# EAGLE schematic MJ838 - rev.1c (EAGLE 9.6.2)
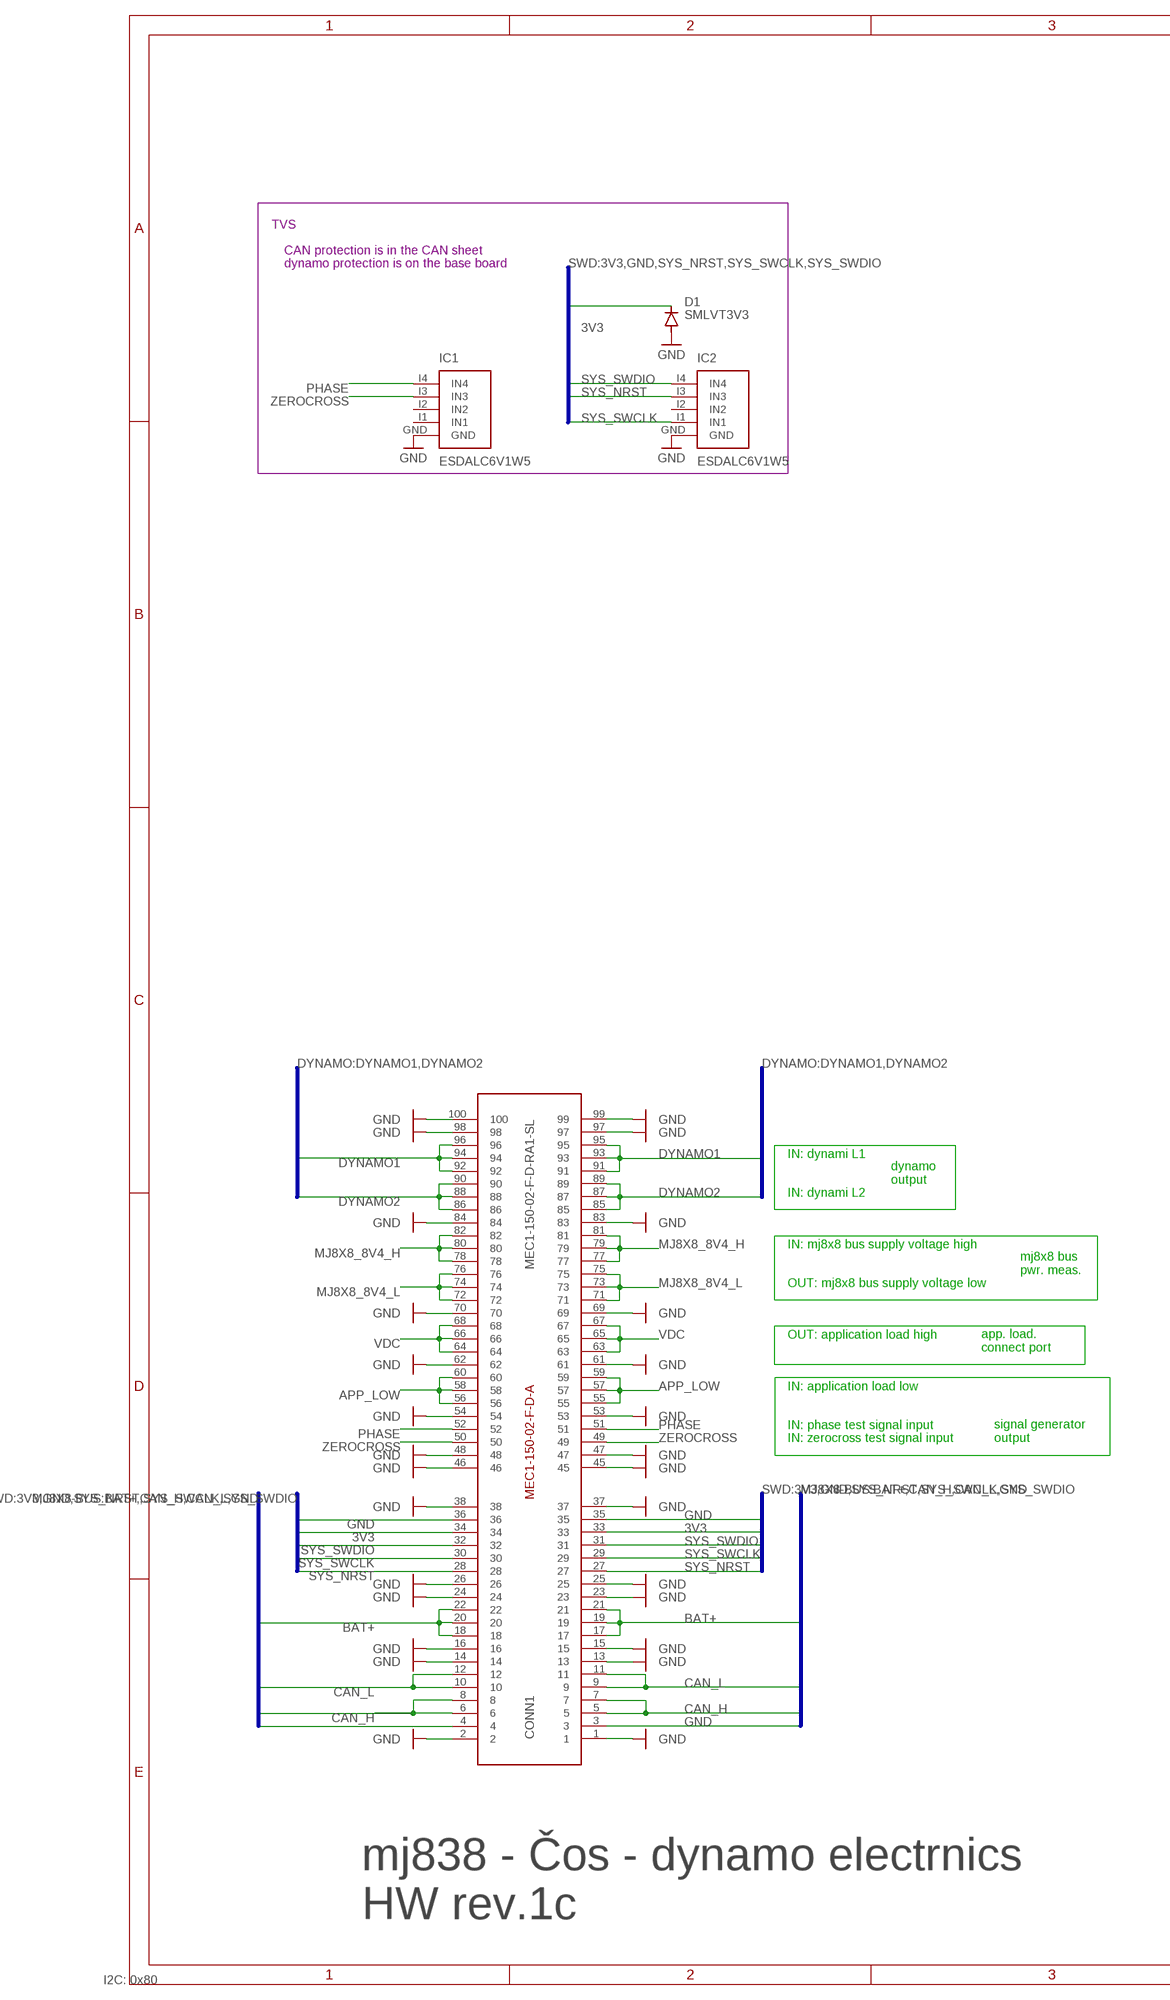
[diagram p0: schematic, sheet 1, part 1 of 2]
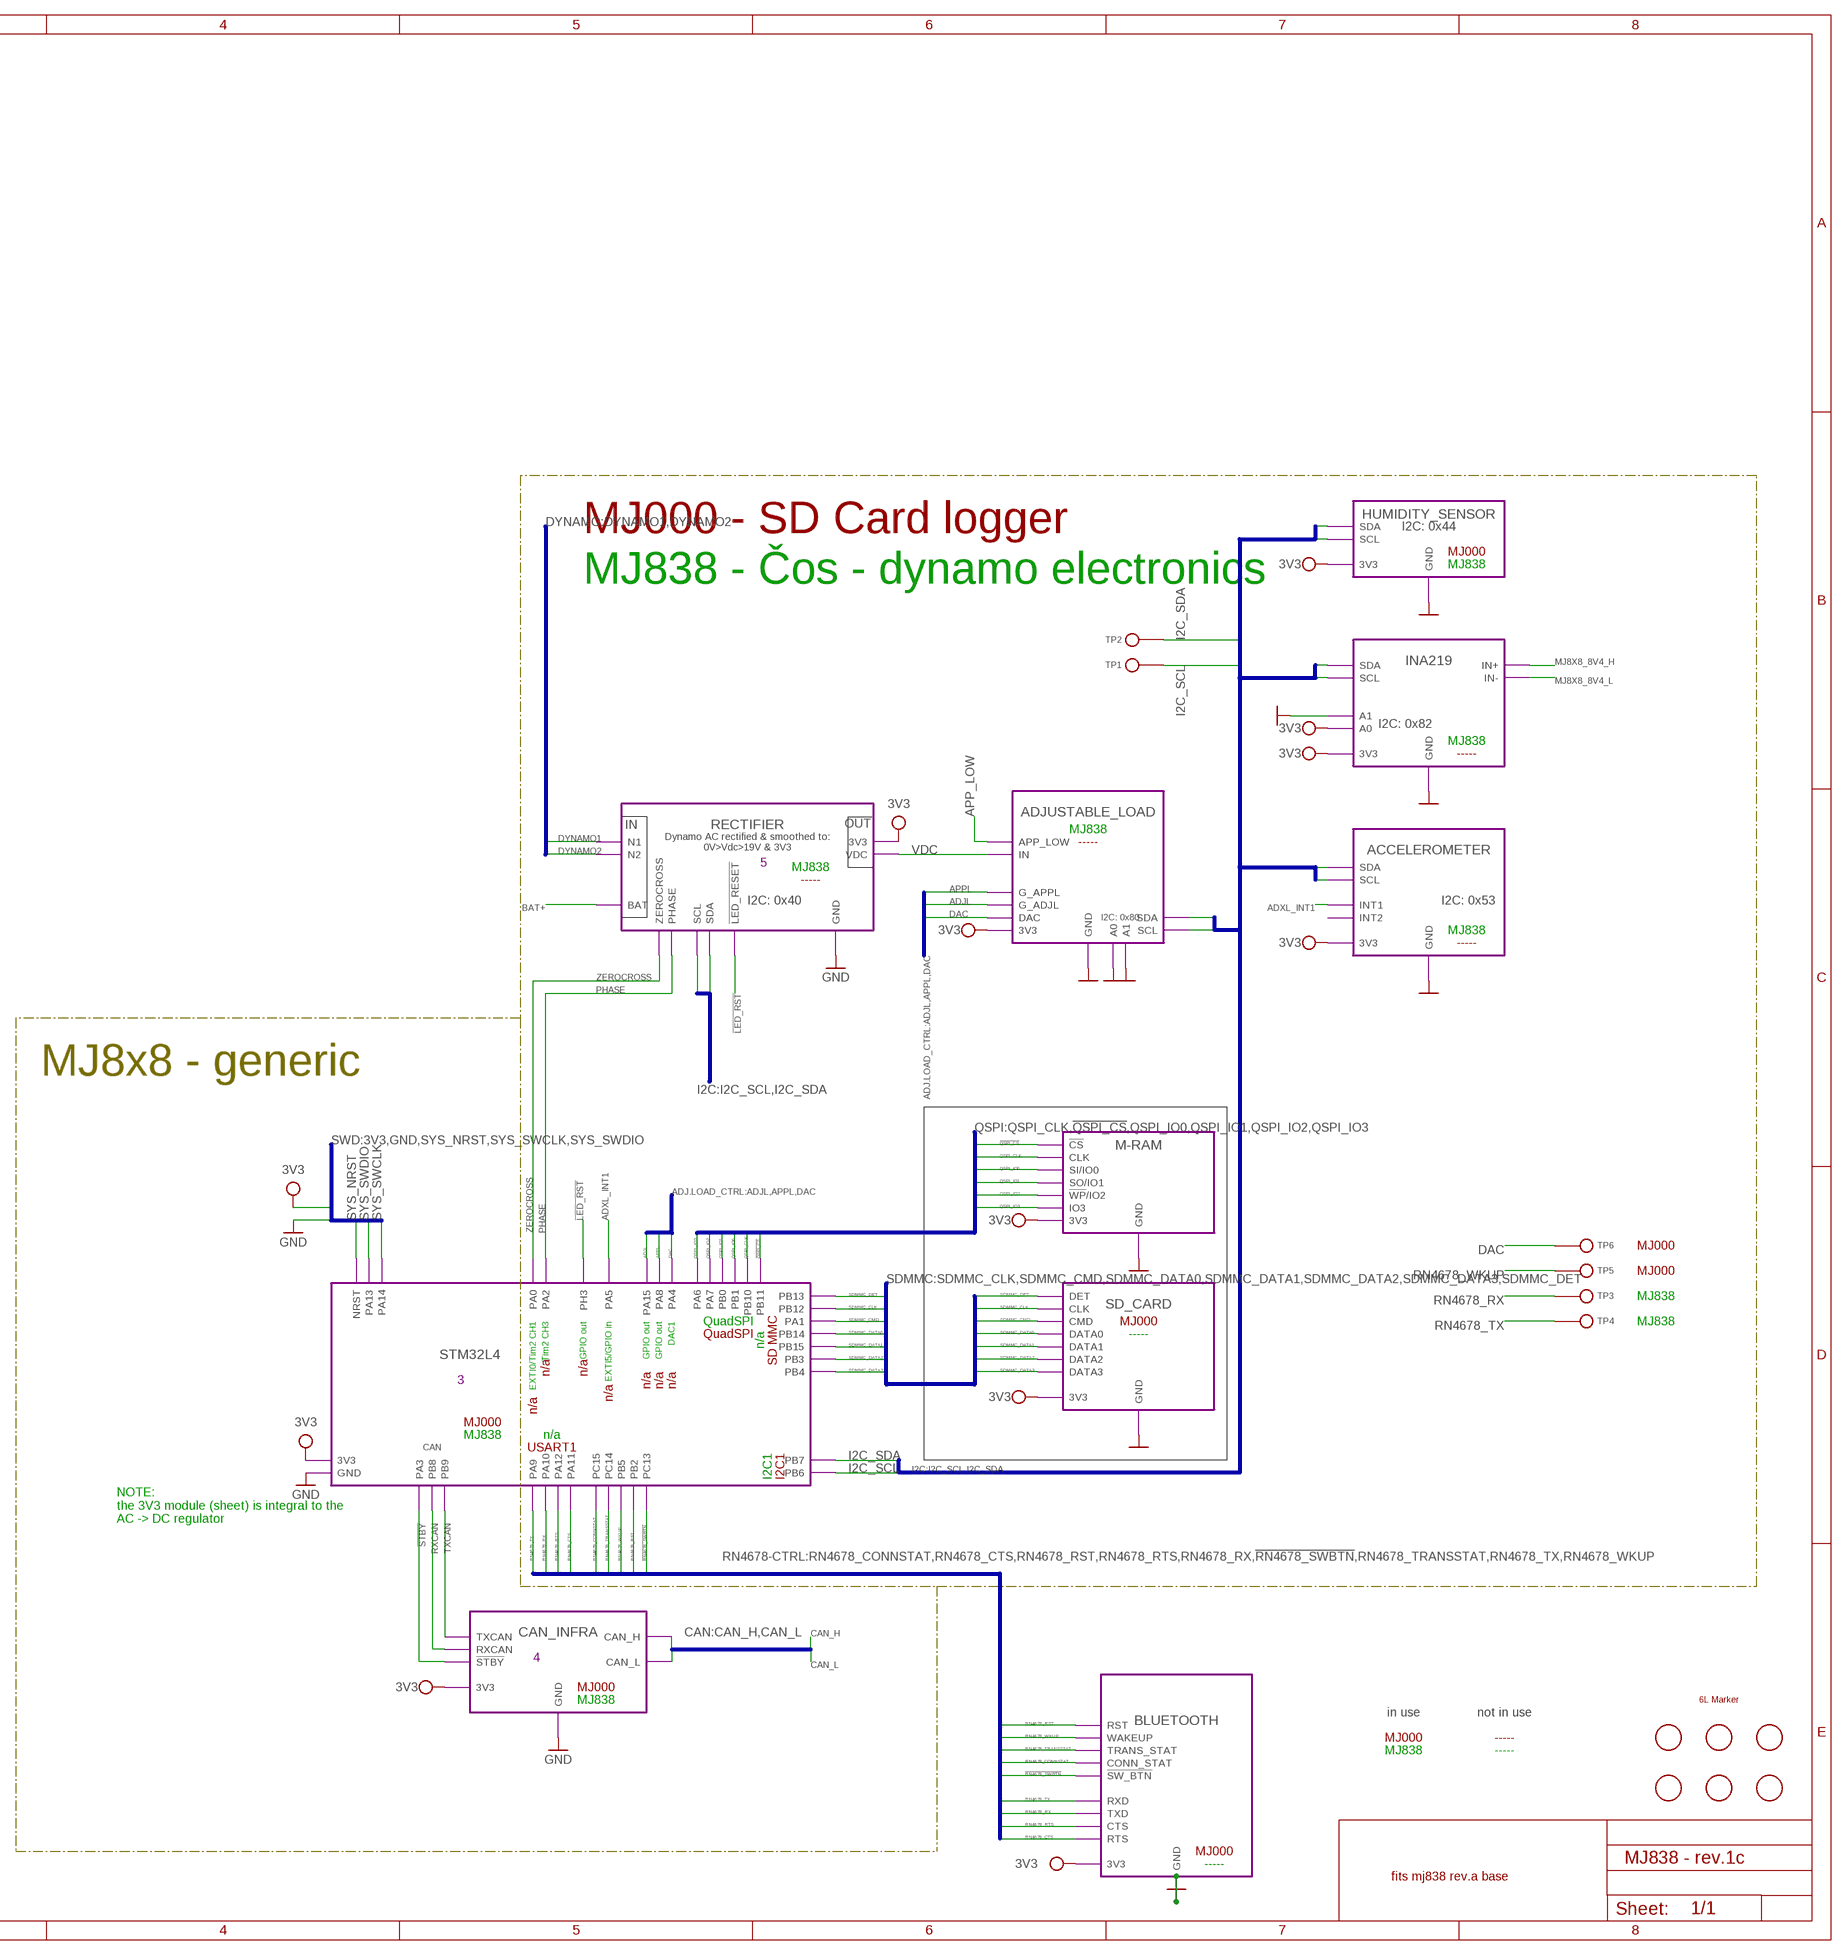
[diagram p1: schematic, sheet 1, part 2 of 2]

## Parts
CONN1  MEC1-150-02-F-D-RA1-SL  CARD-EDGE  [SMD]
D1  SMLVT3V3  DIODE-SMB  [SMB]
FID1  n/a  FIDUCIALFID_1MM  [FIDUCIAL_1MM]
FID2  n/a  FIDUCIALFID_1MM  [FIDUCIAL_1MM]
FID3  n/a  FIDUCIALFID_1MM  [FIDUCIAL_1MM]
FID4  n/a  FIDUCIALFID_1MM  [FIDUCIAL_1MM]
FID5  n/a  FIDUCIALFID_1MM  [FIDUCIAL_1MM]
FID6  n/a  FIDUCIALFID_1MM  [FIDUCIAL_1MM]
IC1  ESDALC6V1W5  ESDALC6  [SOT323-5]
IC2  ESDALC6V1W5  ESDALC6  [SOT323-5]
MARKER1  6 layer  6L  [6L]
TP1  CAN high  TPTH-0.9  [TH-0.9]
TP2  CAN high  TPTH-0.9  [TH-0.9]
TP3  CAN high  TPTH-0.9  [TH-0.9]
TP4  CAN high  TPTH-0.9  [TH-0.9]
TP5  CAN high  TPTH-0.9  [TH-0.9]
TP6  CAN high  TPTH-0.9  [TH-0.9]

## Module instances
STM32L4 = STM32
CAN_INFRA = CAN_INFRA
RECTIFIER = RECTIFIER
ADJUSTABLE_LOAD = ADJUSTABLE_LOAD
M-RAM = M-RAM
HUMIDITY_SENSOR = HUMIDITY
INA1 = INA219
SD_CARD = SD_CARD
ACCELEROMETER = ACCELEROMETER
BLUETOOTH = BLUETOOTH

## Nets
3V3 [3V3]: CONN1.33 CONN1.34 D1.C ; port STM32L4.3V3 CAN_INFRA.3V3 RECTIFIER.3V3 M-RAM.3V3 HUMIDITY_SENSOR.3V3 INA1.3V3 INA1.A0 ACCELEROMETER.3V3 ADJUSTABLE_LOAD.3V3 SD_CARD.3V3 BLUETOOTH.3V3
!LED_RST! [signal]: port RECTIFIER.!LED_RESET! STM32L4.PH3
!QSPI_CS! [signal]: port M-RAM.!CS! STM32L4.PB11
!RN4678_SWBTN! [signal]: port BLUETOOTH.!SW_BTN! STM32L4.PC13
!STBY! [signal]: port CAN_INFRA.!STBY! STM32L4.PA3
ADJL [signal]: port ADJUSTABLE_LOAD.G_ADJL STM32L4.PA15
ADXL_INT1 [signal]: port ACCELEROMETER.INT1 STM32L4.PA5
APP_LOW [signal]: CONN1.55 CONN1.56 CONN1.57 CONN1.58 CONN1.59 CONN1.60 ; port ADJUSTABLE_LOAD.APP_LOW
APPL [signal]: port ADJUSTABLE_LOAD.G_APPL STM32L4.PA8
BAT+ [BAT+]: CONN1.17 CONN1.18 CONN1.19 CONN1.20 CONN1.21 CONN1.22 ; port RECTIFIER.BAT
CAN_H [signal]: CONN1.5 CONN1.6 CONN1.7 CONN1.8 ; port CAN_INFRA.CAN_H
CAN_L [signal]: CONN1.9 CONN1.10 CONN1.11 CONN1.12 ; port CAN_INFRA.CAN_L
DAC [signal]: TP6.P$1(TP$1) ; port ADJUSTABLE_LOAD.DAC STM32L4.PA4
DYNAMO1 [Vdynamo]: CONN1.91 CONN1.92 CONN1.93 CONN1.94 CONN1.95 CONN1.96 ; port RECTIFIER.N1
DYNAMO2 [Vdynamo]: CONN1.85 CONN1.86 CONN1.87 CONN1.88 CONN1.89 CONN1.90 ; port RECTIFIER.N2
GND: CONN1.1 CONN1.2 CONN1.3 CONN1.4 CONN1.13 CONN1.14 CONN1.15 CONN1.16 CONN1.23 CONN1.24 CONN1.25 CONN1.26 CONN1.35 CONN1.36 CONN1.37 CONN1.38 CONN1.45 CONN1.46 CONN1.47 CONN1.48 CONN1.53 CONN1.54 CONN1.61 CONN1.62 CONN1.69 CONN1.70 CONN1.83 CONN1.84 CONN1.97 CONN1.98 CONN1.99 CONN1.100 D1.A IC1.GND IC2.GND ; port CAN_INFRA.GND RECTIFIER.GND ADJUSTABLE_LOAD.GND M-RAM.GND HUMIDITY_SENSOR.GND INA1.GND INA1.A1 SD_CARD.GND ACCELEROMETER.GND STM32L4.GND ADJUSTABLE_LOAD.A0 ADJUSTABLE_LOAD.A1 BLUETOOTH.GND
I2C_SCL [signal]: TP1.P$1(TP$1) ; port HUMIDITY_SENSOR.SCL RECTIFIER.SCL INA1.SCL ACCELEROMETER.SCL STM32L4.PB6 ADJUSTABLE_LOAD.SCL
I2C_SDA [signal]: TP2.P$1(TP$1) ; port HUMIDITY_SENSOR.SDA RECTIFIER.SDA INA1.SDA ACCELEROMETER.SDA STM32L4.PB7 ADJUSTABLE_LOAD.SDA
MJ8X8_8V4_H [BAT+]: CONN1.77 CONN1.78 CONN1.79 CONN1.80 CONN1.81 CONN1.82 ; port INA1.IN+
MJ8X8_8V4_L [BAT+]: CONN1.71 CONN1.72 CONN1.73 CONN1.74 CONN1.75 CONN1.76 ; port INA1.IN-
PHASE [signal]: CONN1.51 CONN1.52 IC1.I4(IN4) ; port RECTIFIER.PHASE STM32L4.PA2
QSPI_CLK [signal]: port M-RAM.CLK STM32L4.PB10
QSPI_IO0 [signal]: port M-RAM.SI/IO0 STM32L4.PB1
QSPI_IO1 [signal]: port M-RAM.SO/IO1 STM32L4.PB0
QSPI_IO2 [signal]: port M-RAM.!WP!/IO2 STM32L4.PA7
QSPI_IO3 [signal]: port M-RAM.IO3 STM32L4.PA6
RN4678_CONNSTAT [signal]: port BLUETOOTH.CONN_STAT STM32L4.PC15
RN4678_CTS [signal]: port STM32L4.PA11 BLUETOOTH.RTS
RN4678_RST [signal]: port BLUETOOTH.RST STM32L4.PB2
RN4678_RTS [signal]: port STM32L4.PA12 BLUETOOTH.CTS
RN4678_RX [signal]: TP3.P$1(TP$1) ; port STM32L4.PA10 BLUETOOTH.TXD
RN4678_TRANSSTAT [signal]: port BLUETOOTH.TRANS_STAT STM32L4.PC14
RN4678_TX [signal]: TP4.P$1(TP$1) ; port STM32L4.PA9 BLUETOOTH.RXD
RN4678_WKUP [signal]: TP5.P$1(TP$1) ; port BLUETOOTH.WAKEUP STM32L4.PB5
RXCAN [signal]: port CAN_INFRA.RXCAN STM32L4.PB8
SDMMC_CLK [signal]: port SD_CARD.CLK STM32L4.PB12
SDMMC_CMD [signal]: port SD_CARD.CMD STM32L4.PA1
SDMMC_DATA0 [signal]: port SD_CARD.DATA0 STM32L4.PB14
SDMMC_DATA1 [signal]: port SD_CARD.DATA1 STM32L4.PB15
SDMMC_DATA2 [signal]: port SD_CARD.DATA2 STM32L4.PB3
SDMMC_DATA3 [signal]: port SD_CARD.DATA3 STM32L4.PB4
SDMMC_DET [signal]: port SD_CARD.DET STM32L4.PB13
SYS_NRST [signal]: CONN1.27 CONN1.28 IC2.I3(IN3) ; port STM32L4.NRST
SYS_SWCLK [signal]: CONN1.29 CONN1.30 IC2.I1(IN1) ; port STM32L4.PA14
SYS_SWDIO [signal]: CONN1.31 CONN1.32 IC2.I4(IN4) ; port STM32L4.PA13
TXCAN [signal]: port STM32L4.PB9 CAN_INFRA.TXCAN
VDC [Vdc]: CONN1.63 CONN1.64 CONN1.65 CONN1.66 CONN1.67 CONN1.68 ; port ADJUSTABLE_LOAD.IN RECTIFIER.VDC
ZEROCROSS [signal]: CONN1.49 CONN1.50 IC1.I3(IN3) ; port RECTIFIER.ZEROCROSS STM32L4.PA0
Unconnected: IC1.I1(IN1) IC1.I2(IN2) IC2.I2(IN2)

## Buses
CAN:CAN_H,CAN_L
SWD:3V3,GND,SYS_NRST,SYS_SWCLK,SYS_SWDIO
I2C:I2C_SCL,I2C_SDA
MJ8X8-BUS:BAT+,CAN_H,CAN_L,GND
DYNAMO:DYNAMO1,DYNAMO2
SDMMC:SDMMC_CLK,SDMMC_CMD,SDMMC_DATA0,SDMMC_DATA1,SDMMC_DATA2,SDMMC_DATA3,SDMMC_DET
QSPI:QSPI_CLK,!QSPI_CS!,QSPI_IO0,QSPI_IO1,QSPI_IO2,QSPI_IO3
RN4678-CTRL:RN4678_CONNSTAT,RN4678_CTS,RN4678_RST,RN4678_RTS,RN4678_RX,!RN4678_SWBTN!,RN4678_TRANSSTAT,RN4678_TX,RN4678_WKUP
ADJ.LOAD_CTRL:ADJL,APPL,DAC

## Notes on the sheet
- TVS
- CAN protection is in the CAN sheet
- dynamo protection is on the base board
- MJ000 - SD Card logger
- I2C: 0x44
- MJ838 - Čos - dynamo electronics | MJ000
- MJ838
- I2C: 0x82
- MJ838
- -----
- IN | OUT | MJ838
- Dynamo AC rectified & smoothed to:
  0V>Vdc>19V & 3V3
- -----
- 5 | MJ838
- -----
- I2C: 0x40 | I2C: 0x53
- I2C: 0x80
- MJ838
- -----
- MJ8x8 - generic
- IN: dynami L1
- dynamo
  output
- IN: dynami L2
- IN: mj8x8 bus supply voltage high
- mj8x8 bus
  pwr. meas.
- MJ000
- OUT: mj8x8 bus supply voltage low
- MJ000
- MJ838
- OUT: application load high
- app. load.
  connect port
- EXTI0/Tim2 CH1 | Tim2 CH3 | GPIO out | EXTI5/GPIO in | GPIO out | GPIO out | DAC1 | QuadSPI | MJ000 | MJ838
- QuadSPI | -----
- n/a | SD MMC
- IN: application load low | n/a | n/a
- n/a | n/a | n/a
- 3 | n/a
- IN: phase test signal input | n/a
- IN: zerocross test signal input
- signal generator
  output
- MJ000
- MJ838 | n/a
- CAN | USART1
- I2C1 | I2C1
- NOTE:
  the 3V3 module (sheet) is integral to the
  AC -> DC regulator
- 4
- MJ000
- MJ838
- in use | not in use
- MJ000 | -----
- MJ838 | -----
- MJ000
- -----
- mj838 - Čos - dynamo electrnics
  HW rev.1c
- fits mj838 rev.a base
- I2C: 0x80

## Library data of the parts
CONN1 = Samtec MEC1 - Card Edge Connector:CARD-EDGE
D1 = diode:DIODE-: DIODE
FID1-FID6 = fiducials:FIDUCIAL
IC1 IC2 = ESDALCx - 4c ESD protection:ESDALC6
MARKER1 = Layer Markers:6L
TP1-TP6 = signal testpoint:TP

## Module STM32
Ports: GND(pwr) 3V3(pwr) NRST(in) PA13(io) PA14(in) PB9(out) PB8(in) PB6(out) PB7(io) PB4(io) PB3(io) PB14(io) PB15(io) PA1(io) PB12(out) PB13(in) PB1(io) PB0(io) PA7(io) PA6(io) PA0(in) PA4(out) PB10(out) PB11(out) PA9(out) PA10(in) PA11(in) PA12(out) PA8(out) PA15(out) PA2(in) PH3(out) PA3(out) PA5(in) PC13(out) PC14(in) PC15(in) PB2(out) PB5(out)
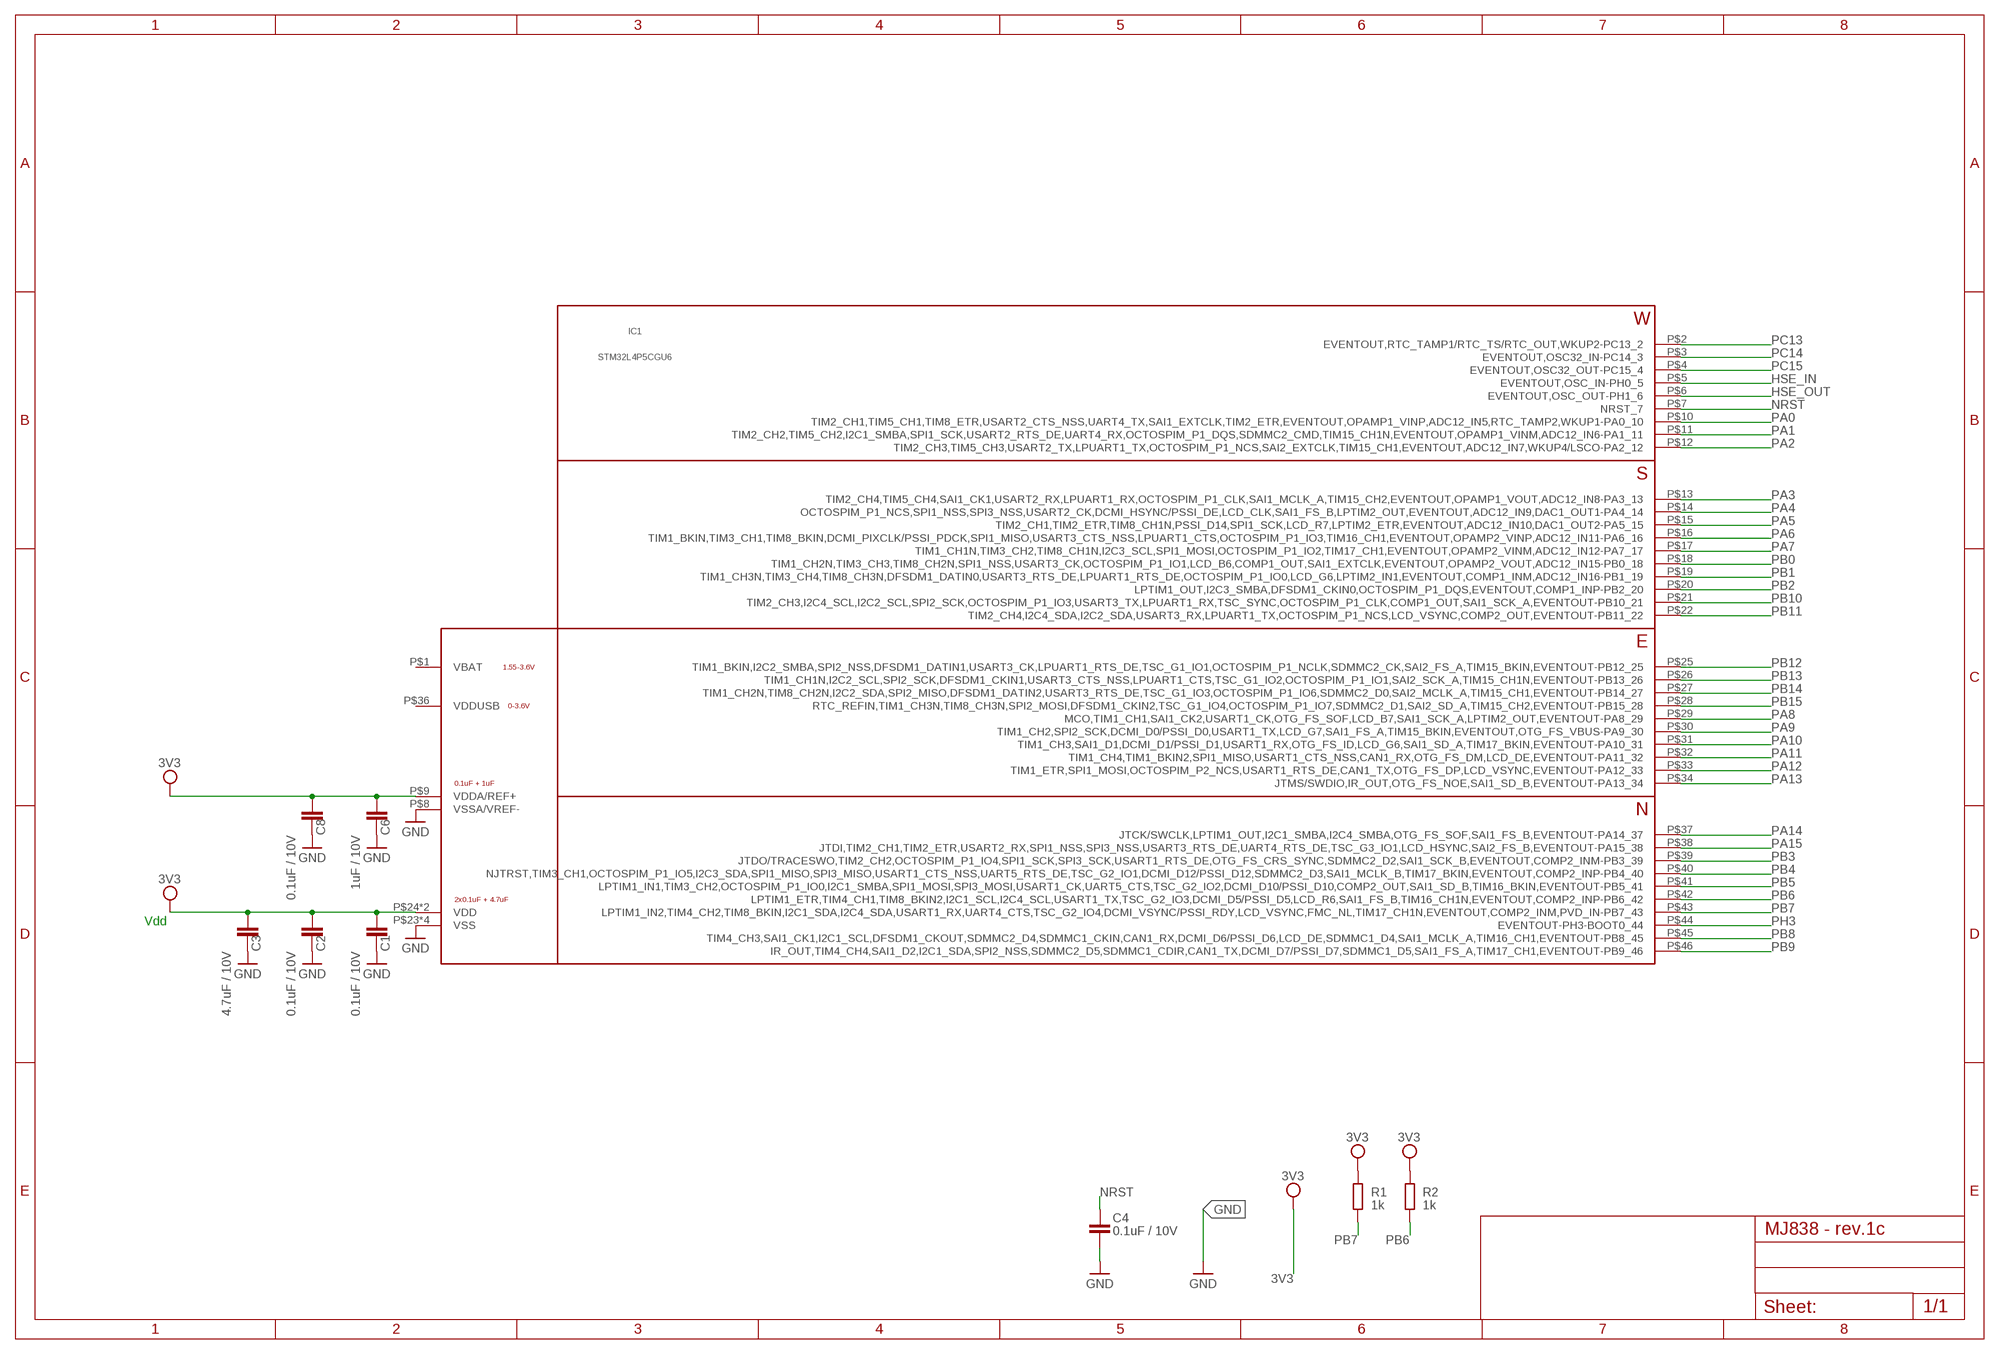
[diagram p2: schematic, module STM32, sheet 1]

### Parts
C1  0.1uF / 10V  C-EUC0402  [C0402]
C2  0.1uF / 10V  C-EUC0402  [C0402]
C3  4.7uF / 10V  C-EUC0402  [C0402]
C4  0.1uF / 10V  C-EUC0402  [C0402]
C6  1uF / 10V  C-EUC0402  [C0402]
C8  0.1uF / 10V  C-EUC0402  [C0402]
IC1  STM32L4P5CGU6  STM32L4P5CEU6  [UFQFPN48]
R1  1k  R-EU_R0402  [R0402]
R2  1k  R-EU_R0402  [R0402]

### Nets
3V3 [3V3]: C1.2 C2.2 C3.2 C6.2 C8.2 IC1.P$9(VDDA/REF+) IC1.P$24(VDD) IC1.P$48(VDD) R1.2 R2.2
GND: C1.1 C2.1 C3.1 C4.1 C6.1 C8.1 IC1.P$8(VSSA/VREF-) IC1.P$23(VSS) IC1.P$35(VSS) IC1.P$47(VSS) IC1.PAD(VSS)
HSE_IN [signal]: IC1.P$5(EVENTOUT,OSC_IN-PH0_5)
HSE_OUT [signal]: IC1.P$6(EVENTOUT,OSC_OUT-PH1_6)
NRST [signal]: C4.2 IC1.P$7(NRST_7)
PA0 [signal]: IC1.P$10(TIM2_CH1,TIM5_CH1,TIM8_ETR,USART2_CTS_NSS,UART4_TX,SAI1_EXTCLK,TIM2_ETR,EVENTOUT,OPAMP1_VINP,ADC12_IN5,RTC_TAMP2,WKUP1-PA0_10)
PA1 [signal]: IC1.P$11(TIM2_CH2,TIM5_CH2,I2C1_SMBA,SPI1_SCK,USART2_RTS_DE,UART4_RX,OCTOSPIM_P1_DQS,SDMMC2_CMD,TIM15_CH1N,EVENTOUT,OPAMP1_VINM,ADC12_IN6-PA1_11)
PA2 [signal]: IC1.P$12(TIM2_CH3,TIM5_CH3,USART2_TX,LPUART1_TX,OCTOSPIM_P1_NCS,SAI2_EXTCLK,TIM15_CH1,EVENTOUT,ADC12_IN7,WKUP4/LSCO-PA2_12)
PA3 [signal]: IC1.P$13(TIM2_CH4,TIM5_CH4,SAI1_CK1,USART2_RX,LPUART1_RX,OCTOSPIM_P1_CLK,SAI1_MCLK_A,TIM15_CH2,EVENTOUT,OPAMP1_VOUT,ADC12_IN8-PA3_13)
PA4 [signal]: IC1.P$14(OCTOSPIM_P1_NCS,SPI1_NSS,SPI3_NSS,USART2_CK,DCMI_HSYNC/PSSI_DE,LCD_CLK,SAI1_FS_B,LPTIM2_OUT,EVENTOUT,ADC12_IN9,DAC1_OUT1-PA4_14)
PA5 [signal]: IC1.P$15(TIM2_CH1,TIM2_ETR,TIM8_CH1N,PSSI_D14,SPI1_SCK,LCD_R7,LPTIM2_ETR,EVENTOUT,ADC12_IN10,DAC1_OUT2-PA5_15)
PA6 [signal]: IC1.P$16(TIM1_BKIN,TIM3_CH1,TIM8_BKIN,DCMI_PIXCLK/PSSI_PDCK,SPI1_MISO,USART3_CTS_NSS,LPUART1_CTS,OCTOSPIM_P1_IO3,TIM16_CH1,EVENTOUT,OPAMP2_VINP,ADC12_IN11-PA6_16)
PA7 [signal]: IC1.P$17(TIM1_CH1N,TIM3_CH2,TIM8_CH1N,I2C3_SCL,SPI1_MOSI,OCTOSPIM_P1_IO2,TIM17_CH1,EVENTOUT,OPAMP2_VINM,ADC12_IN12-PA7_17)
PA8 [signal]: IC1.P$29(MCO,TIM1_CH1,SAI1_CK2,USART1_CK,OTG_FS_SOF,LCD_B7,SAI1_SCK_A,LPTIM2_OUT,EVENTOUT-PA8_29)
PA9 [signal]: IC1.P$30(TIM1_CH2,SPI2_SCK,DCMI_D0/PSSI_D0,USART1_TX,LCD_G7,SAI1_FS_A,TIM15_BKIN,EVENTOUT,OTG_FS_VBUS-PA9_30)
PA10 [signal]: IC1.P$31(TIM1_CH3,SAI1_D1,DCMI_D1/PSSI_D1,USART1_RX,OTG_FS_ID,LCD_G6,SAI1_SD_A,TIM17_BKIN,EVENTOUT-PA10_31)
PA11 [signal]: IC1.P$32(TIM1_CH4,TIM1_BKIN2,SPI1_MISO,USART1_CTS_NSS,CAN1_RX,OTG_FS_DM,LCD_DE,EVENTOUT-PA11_32)
PA12 [signal]: IC1.P$33(TIM1_ETR,SPI1_MOSI,OCTOSPIM_P2_NCS,USART1_RTS_DE,CAN1_TX,OTG_FS_DP,LCD_VSYNC,EVENTOUT-PA12_33)
PA13 [signal]: IC1.P$34(JTMS/SWDIO,IR_OUT,OTG_FS_NOE,SAI1_SD_B,EVENTOUT-PA13_34)
PA14 [signal]: IC1.P$37(JTCK/SWCLK,LPTIM1_OUT,I2C1_SMBA,I2C4_SMBA,OTG_FS_SOF,SAI1_FS_B,EVENTOUT-PA14_37)
PA15 [signal]: IC1.P$38(JTDI,TIM2_CH1,TIM2_ETR,USART2_RX,SPI1_NSS,SPI3_NSS,USART3_RTS_DE,UART4_RTS_DE,TSC_G3_IO1,LCD_HSYNC,SAI2_FS_B,EVENTOUT-PA15_38)
PB0 [signal]: IC1.P$18(TIM1_CH2N,TIM3_CH3,TIM8_CH2N,SPI1_NSS,USART3_CK,OCTOSPIM_P1_IO1,LCD_B6,COMP1_OUT,SAI1_EXTCLK,EVENTOUT,OPAMP2_VOUT,ADC12_IN15-PB0_18)
PB1 [signal]: IC1.P$19(TIM1_CH3N,TIM3_CH4,TIM8_CH3N,DFSDM1_DATIN0,USART3_RTS_DE,LPUART1_RTS_DE,OCTOSPIM_P1_IO0,LCD_G6,LPTIM2_IN1,EVENTOUT,COMP1_INM,ADC12_IN16-PB1_19)
PB2 [signal]: IC1.P$20(LPTIM1_OUT,I2C3_SMBA,DFSDM1_CKIN0,OCTOSPIM_P1_DQS,EVENTOUT,COMP1_INP-PB2_20)
PB3 [signal]: IC1.P$39(JTDO/TRACESWO,TIM2_CH2,OCTOSPIM_P1_IO4,SPI1_SCK,SPI3_SCK,USART1_RTS_DE,OTG_FS_CRS_SYNC,SDMMC2_D2,SAI1_SCK_B,EVENTOUT,COMP2_INM-PB3_39)
PB4 [signal]: IC1.P$40(NJTRST,TIM3_CH1,OCTOSPIM_P1_IO5,I2C3_SDA,SPI1_MISO,SPI3_MISO,USART1_CTS_NSS,UART5_RTS_DE,TSC_G2_IO1,DCMI_D12/PSSI_D12,SDMMC2_D3,SAI1_MCLK_B,TIM17_BKIN,EVENTOUT,COMP2_INP-PB4_40)
PB5 [signal]: IC1.P$41(LPTIM1_IN1,TIM3_CH2,OCTOSPIM_P1_IO0,I2C1_SMBA,SPI1_MOSI,SPI3_MOSI,USART1_CK,UART5_CTS,TSC_G2_IO2,DCMI_D10/PSSI_D10,COMP2_OUT,SAI1_SD_B,TIM16_BKIN,EVENTOUT-PB5_41)
PB6 [signal]: IC1.P$42(LPTIM1_ETR,TIM4_CH1,TIM8_BKIN2,I2C1_SCL,I2C4_SCL,USART1_TX,TSC_G2_IO3,DCMI_D5/PSSI_D5,LCD_R6,SAI1_FS_B,TIM16_CH1N,EVENTOUT,COMP2_INP-PB6_42) R2.1
PB7 [signal]: IC1.P$43(LPTIM1_IN2,TIM4_CH2,TIM8_BKIN,I2C1_SDA,I2C4_SDA,USART1_RX,UART4_CTS,TSC_G2_IO4,DCMI_VSYNC/PSSI_RDY,LCD_VSYNC,FMC_NL,TIM17_CH1N,EVENTOUT,COMP2_INM,PVD_IN-PB7_43) R1.1
PB8 [signal]: IC1.P$45(TIM4_CH3,SAI1_CK1,I2C1_SCL,DFSDM1_CKOUT,SDMMC2_D4,SDMMC1_CKIN,CAN1_RX,DCMI_D6/PSSI_D6,LCD_DE,SDMMC1_D4,SAI1_MCLK_A,TIM16_CH1,EVENTOUT-PB8_45)
PB9 [signal]: IC1.P$46(IR_OUT,TIM4_CH4,SAI1_D2,I2C1_SDA,SPI2_NSS,SDMMC2_D5,SDMMC1_CDIR,CAN1_TX,DCMI_D7/PSSI_D7,SDMMC1_D5,SAI1_FS_A,TIM17_CH1,EVENTOUT-PB9_46)
PB10 [signal]: IC1.P$21(TIM2_CH3,I2C4_SCL,I2C2_SCL,SPI2_SCK,OCTOSPIM_P1_IO3,USART3_TX,LPUART1_RX,TSC_SYNC,OCTOSPIM_P1_CLK,COMP1_OUT,SAI1_SCK_A,EVENTOUT-PB10_21)
PB11 [signal]: IC1.P$22(TIM2_CH4,I2C4_SDA,I2C2_SDA,USART3_RX,LPUART1_TX,OCTOSPIM_P1_NCS,LCD_VSYNC,COMP2_OUT,EVENTOUT-PB11_22)
PB12 [signal]: IC1.P$25(TIM1_BKIN,I2C2_SMBA,SPI2_NSS,DFSDM1_DATIN1,USART3_CK,LPUART1_RTS_DE,TSC_G1_IO1,OCTOSPIM_P1_NCLK,SDMMC2_CK,SAI2_FS_A,TIM15_BKIN,EVENTOUT-PB12_25)
PB13 [signal]: IC1.P$26(TIM1_CH1N,I2C2_SCL,SPI2_SCK,DFSDM1_CKIN1,USART3_CTS_NSS,LPUART1_CTS,TSC_G1_IO2,OCTOSPIM_P1_IO1,SAI2_SCK_A,TIM15_CH1N,EVENTOUT-PB13_26)
PB14 [signal]: IC1.P$27(TIM1_CH2N,TIM8_CH2N,I2C2_SDA,SPI2_MISO,DFSDM1_DATIN2,USART3_RTS_DE,TSC_G1_IO3,OCTOSPIM_P1_IO6,SDMMC2_D0,SAI2_MCLK_A,TIM15_CH1,EVENTOUT-PB14_27)
PB15 [signal]: IC1.P$28(RTC_REFIN,TIM1_CH3N,TIM8_CH3N,SPI2_MOSI,DFSDM1_CKIN2,TSC_G1_IO4,OCTOSPIM_P1_IO7,SDMMC2_D1,SAI2_SD_A,TIM15_CH2,EVENTOUT-PB15_28)
PC13 [signal]: IC1.P$2(EVENTOUT,RTC_TAMP1/RTC_TS/RTC_OUT,WKUP2-PC13_2)
PC14 [signal]: IC1.P$3(EVENTOUT,OSC32_IN-PC14_3)
PC15 [signal]: IC1.P$4(EVENTOUT,OSC32_OUT-PC15_4)
PH3: IC1.P$44(EVENTOUT-PH3-BOOT0_44)

### Notes on the sheet
- Vdd

### Power pins joined to a net without a drawn wire
VBAT: IC1.P$1(VBAT)
VDDUSB: IC1.P$36(VDDUSB)

### Library data of the parts
C1 C2 C4 C6 = rcl:C-EU: CAPACITOR, European symbol; MFRNO: GRM155R62A104KE14J; SPICEPREFIX: C
C3 = rcl:C-EU: CAPACITOR, European symbol; MFRNO: GRM155R61A475MEAAJ; SPICEPREFIX: C
C8 = rcl:C-EU: CAPACITOR, European symbol; MFRNO: GRM155R61H105ME05J; SPICEPREFIX: C
IC1 = STM32L4P5xx:STM32L4P5CEU6
R1 R2 = rcl:R-EU_: RESISTOR, European symbol; MFRNO: ERA-2VEB1001X; SPICEPREFIX: R

## Module CAN_INFRA
Ports: GND(pwr) 3V3(pwr) CAN_H(io) CAN_L(io) TXCAN(in) RXCAN(out) !STBY!(in)
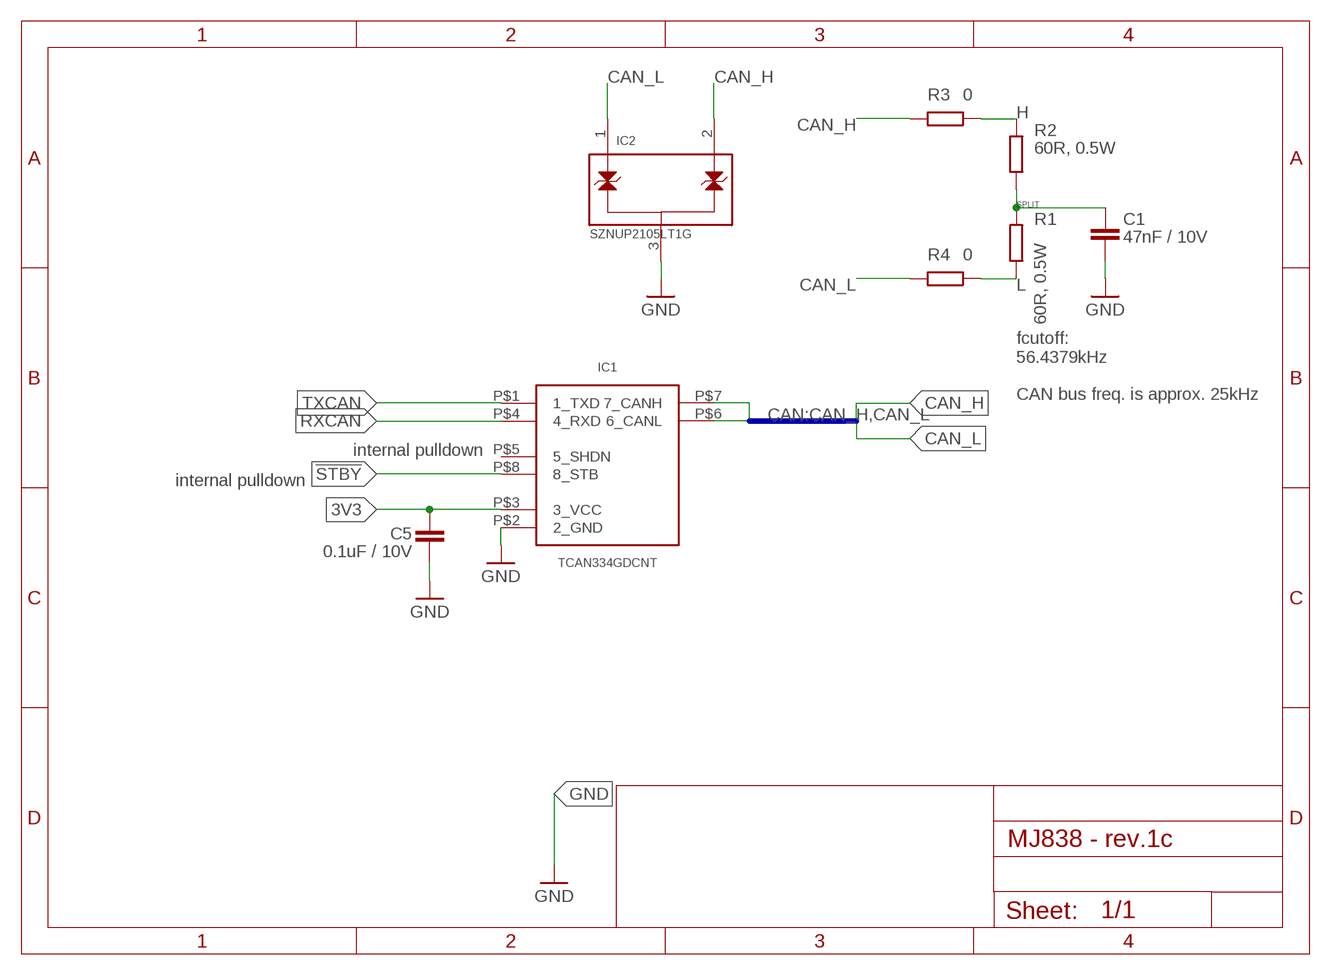
[diagram p3: schematic, module CAN_INFRA, sheet 1]

### Parts
C1  47nF / 10V  C-EUC0402  [C0402]
C5  0.1uF / 10V  C-EUC0402  [C0402]
IC1  TCAN334GDCNT  CAN33X  [SOT23-8]
IC2  SZNUP2105LT1G  NUP2105L  [SOT-23-3]
R1  60R, 0.5W  R-EU_R0805  [R0805]
R2  60R, 0.5W  R-EU_R0805  [R0805]
R3  0  R-EU_R0402  [R0402]
R4  0  R-EU_R0402  [R0402]

### Nets
3V3 [3V3]: C5.1 IC1.P$3(3_VCC)
!STBY! [signal]: IC1.P$8(8_STB)
CAN_H [signal]: IC1.P$7(7_CANH) IC2.2(PIN2) R3.2
CAN_L [signal]: IC1.P$6(6_CANL) IC2.1(PIN1) R4.2
GND: C1.2 C5.2 IC1.P$2(2_GND) IC2.3(PIN3)
H [signal]: R2.2 R3.1
L [signal]: R1.1 R4.1
RXCAN [signal]: IC1.P$4(4_RXD)
SPLIT [signal]: C1.1 R1.2 R2.1
TXCAN [signal]: IC1.P$1(1_TXD)
Unconnected: IC1.P$5(5_SHDN)

### Buses
CAN:CAN_H,CAN_L

### Notes on the sheet
- fcutoff:
  56.4379kHz
  
  CAN bus freq. is approx. 25kHz
- internal pulldown
- internal pulldown

### Library data of the parts
C1 C5 = rcl:C-EU: CAPACITOR, European symbol; SPICEPREFIX: C
IC1 = TCAN33x - 3.3V CAN Transciever:CAN33X
IC2 = NUP2105L - 27V ESD Protection Diode:NUP2105L
R1-R4 = rcl:R-EU_: RESISTOR, European symbol; SPICEPREFIX: R

## Module ZERO-CROSS_DETECTOR
Ports: GND(pwr) OUT(out) 3V3(pwr) AC(in)
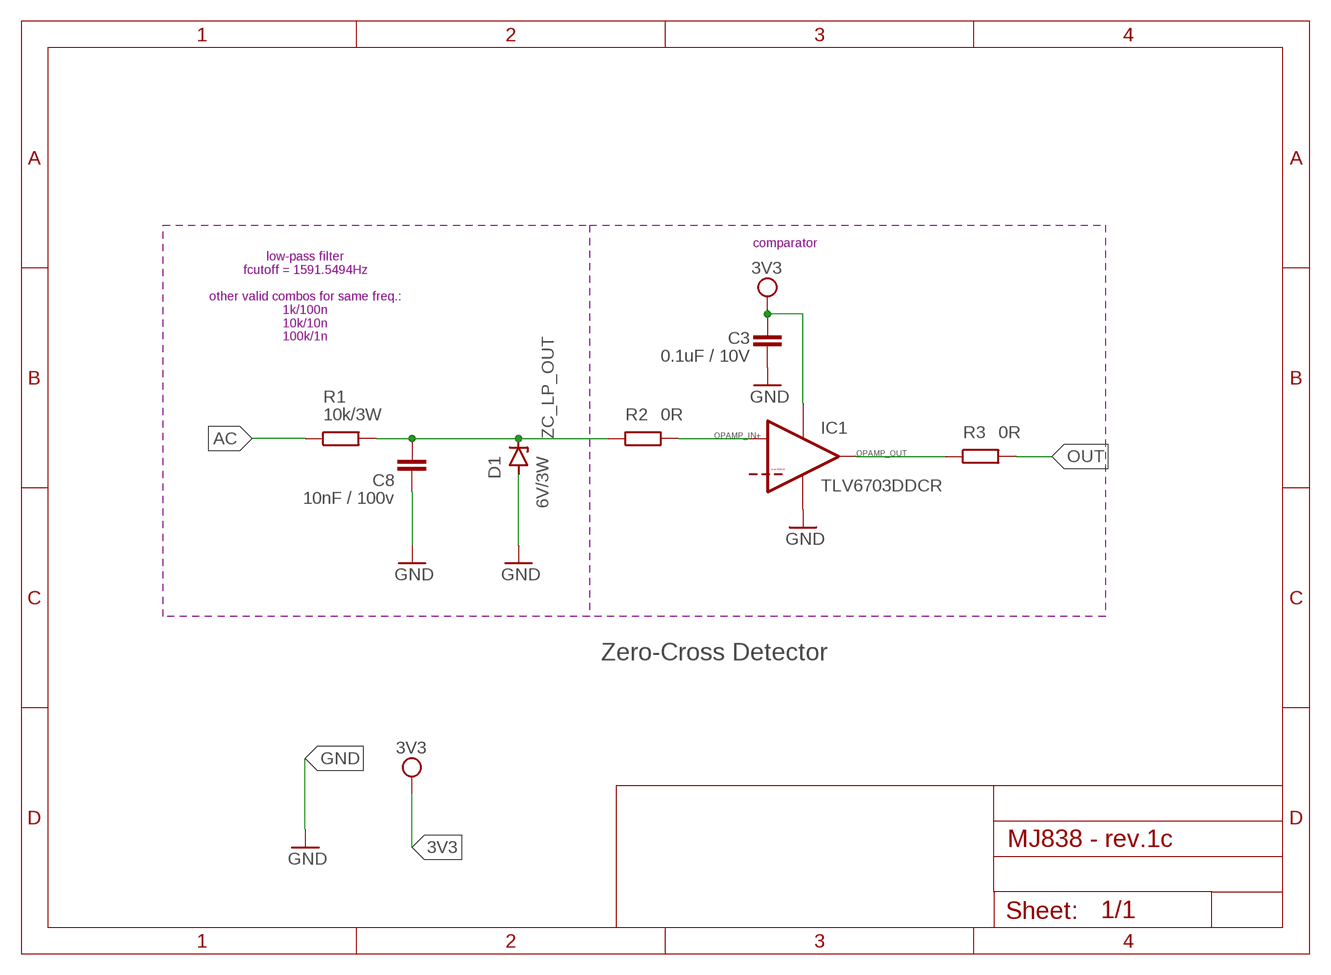
[diagram p4: schematic, module ZERO-CROSS_DETECTOR, sheet 1]

### Parts
C3  0.1uF / 10V  C-EUC0402  [C0402]
C8  10nF / 100v  C-EUC1812  [C1812]
D1  6V/3W  ZENER-DIODEDO214AA  [DO214AA]
IC1  TLV6703DDCR  TLV6703  [SOT-23]
R1  10k/3W  R-EU_R2512  [R2512]
R2  0R  R-EU_R0603  [R0603]
R3  0R  R-EU_R0603  [R0603]

### Nets
3V3 [3V3]: C3.2 IC1.P$5(VDD)
AC [Vdynamo]: R1.1
GND: C3.1 C8.1 D1.A IC1.P$2(GND) IC1.P$4(GND) IC1.P$6(GND)
OPAMP_IN+ [Vdynamo]: IC1.P$3(SENSE) R2.2
OPAMP_OUT [signal]: IC1.P$1(OUT) R3.1
OUT [signal]: R3.2
ZC_LP_OUT [Vdynamo]: C8.2 D1.C R1.2 R2.1

### Notes on the sheet
- comparator
- low-pass filter
  fcutoff = 1591.5494Hz
  
  other valid combos for same freq.:
  1k/100n
  10k/10n
  100k/1n
- Zero-Cross Detector

### Library data of the parts
C3 C8 = rcl:C-EU: CAPACITOR, European symbol; SPICEPREFIX: C
D1 = diode:ZENER-DIODE: Z-Diode
IC1 = TLV6703 - Comparator:TLV6703
R1-R3 = rcl:R-EU_: RESISTOR, European symbol; SPICEPREFIX: R

## Module 3V3
Ports: GND(pwr) VIN(pwr) 3V3(pwr)
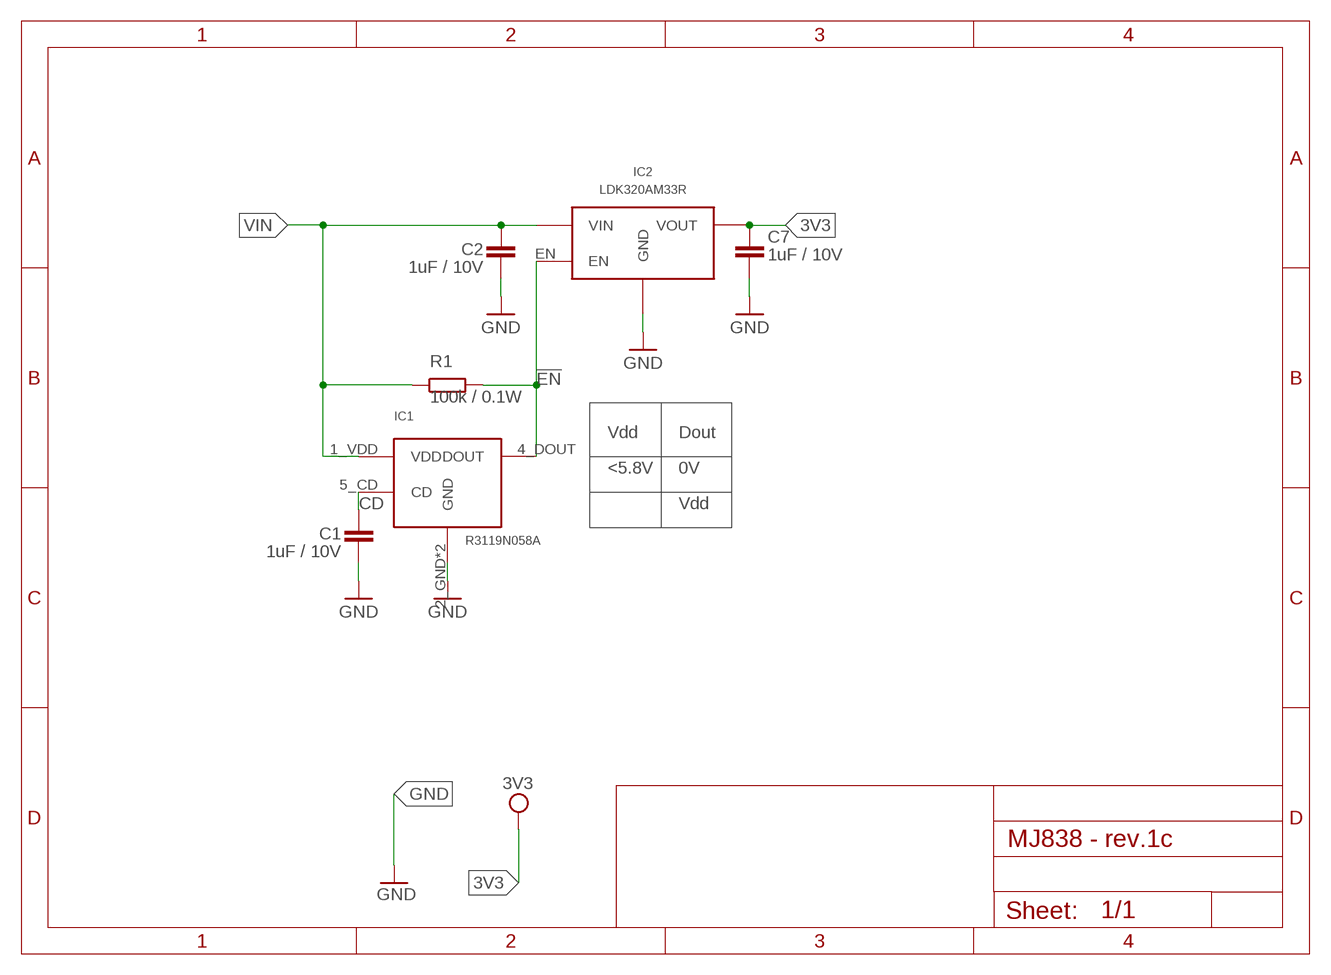
[diagram p5: schematic, module 3V3, sheet 1]

### Parts
C1  1uF / 10V  C-EUC0402  [C0402]
C2  1uF / 10V  C-EUC0402  [C0402]
C7  1uF / 10V  C-EUC0402  [C0402]
IC1  R3119N058A  R3119XXXA  [SOT23-5]
IC2  LDK320AM33R  LDK320SOT-23-5L  [SOT-23-5L]
R1  100k / 0.1W  R-EU_R0402  [R0402]

### Nets
3V3 [3V3]: C7.2 IC2.OUT(VOUT)
!EN! [Vdc]: IC1.4_DOUT(DOUT) IC2.EN R1.2
CD [3V3]: C1.1 IC1.5_CD(CD)
GND: C1.2 C2.2 C7.1 IC1.2_GND(GND) IC1.3_GND(GND) IC2.GND
VIN [Vdc]: C2.1 IC1.1_VDD(VDD) IC2.IN(VIN) R1.1

### Notes on the sheet
- Vdd | Dout
- <5.8V | 0V
- Vdd

### Library data of the parts
C1 C2 C7 = rcl:C-EU: CAPACITOR, European symbol; SPICEPREFIX: C
IC1 = R3119x - Input Voltage Detector:R3119XXXA
IC2 = LDK320 5V LDO:LDK320
R1 = rcl:R-EU_: RESISTOR, European symbol; SPICEPREFIX: R

## Module SMOOTHING_CAP
Ports: GND(pwr) VIN(pwr) VOUT(pwr)
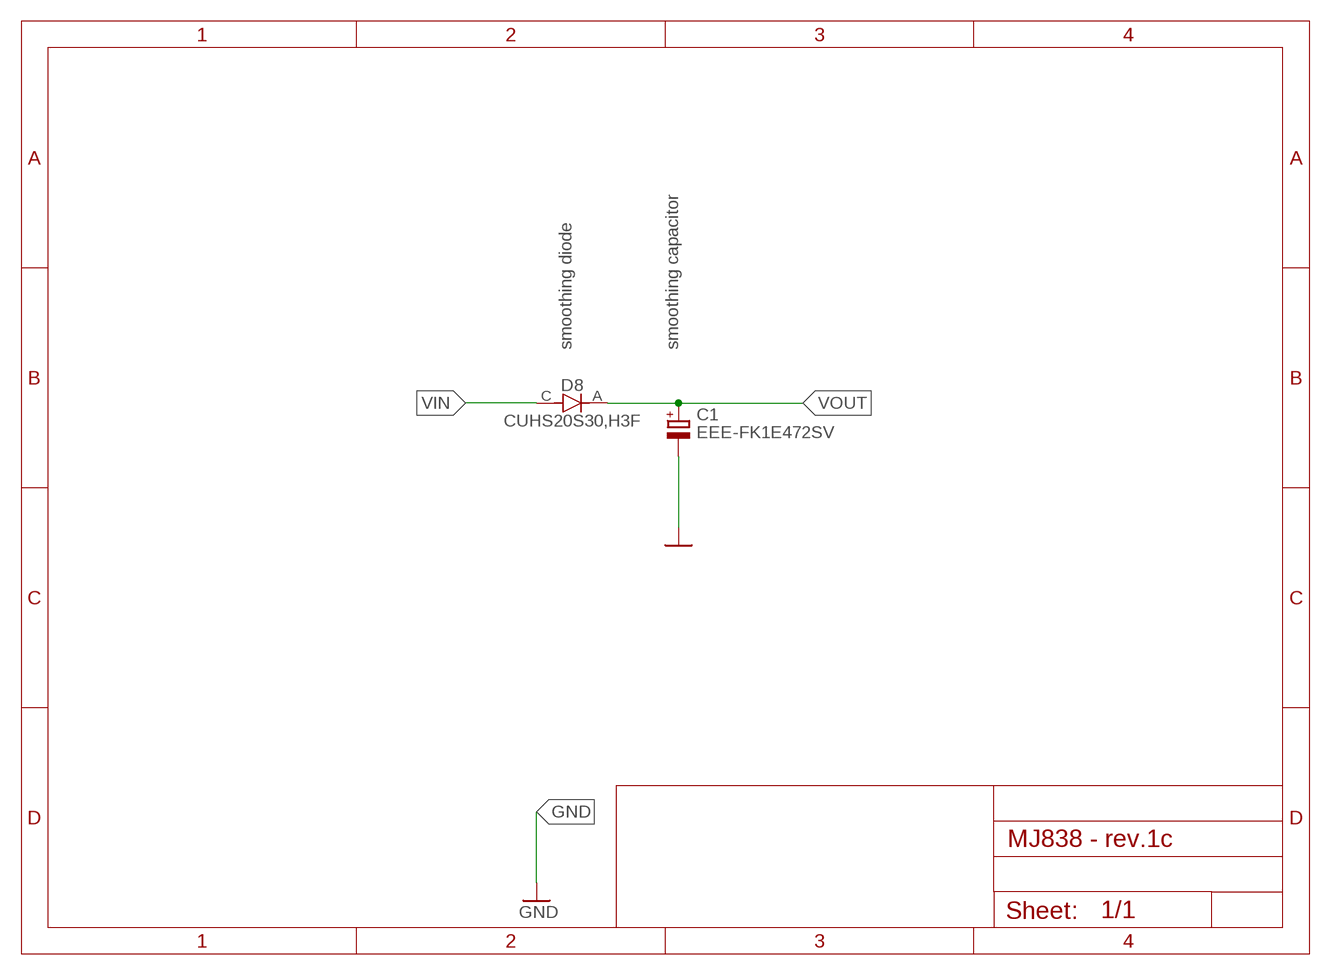
[diagram p6: schematic, module SMOOTHING_CAP, sheet 1]

### Parts
C1  EEE-FK1E472SV  EEEFK1E472SV  [CAP_EEEFK1E472SV]
D8  CUHS20S30,H3F  CUHS20S30  [US2H]

### Nets
GND: C1.-
VIN [Vac]: D8.C
VOUT [Vdc]: C1.+ D8.A

### Notes on the sheet
- smoothing diode | smoothing capacitor

### Library data of the parts
C1 = EEEFK1E472SV:EEEFK1E472SV: Check availability <https://pricing.snapeda.com/parts/EEE-FK1E472SV/Panasonic%20Electronic/view-part?ref=eda>; AVAILABILITY: In Stock; CHECK_PRICES: https://www.snapeda.com/parts/EEE-FK1E472SV/Panasonic/view-part/?ref=eda; DESCRIPTION: Cap Aluminum Lytic 4700uF 25V 20% (18 X 21.5mm) SMD 2640mA 5000h 105C Automotive T/R; MF: Panasonic Electronic; MP: EEE-FK1E472SV; PACKAGE: RADIAL-2 Panasonic; PRICE: None; SNAPEDA_LINK: https://www.snapeda.com/parts/EEE-FK1E472SV/Panasonic/view-part/?ref=snap
D8 = CUHS20S30 - Schottky Barrier Diode:CUHS20S30

## Module ATM_NOT_USED
Ports: SSR_ANODE(pwr) SW1_IN(hiz) SW2_IN(hiz) SW1_OUT(hiz) SW2_OUT(hiz) SW1_CAT(in) SW2_CAT(in)
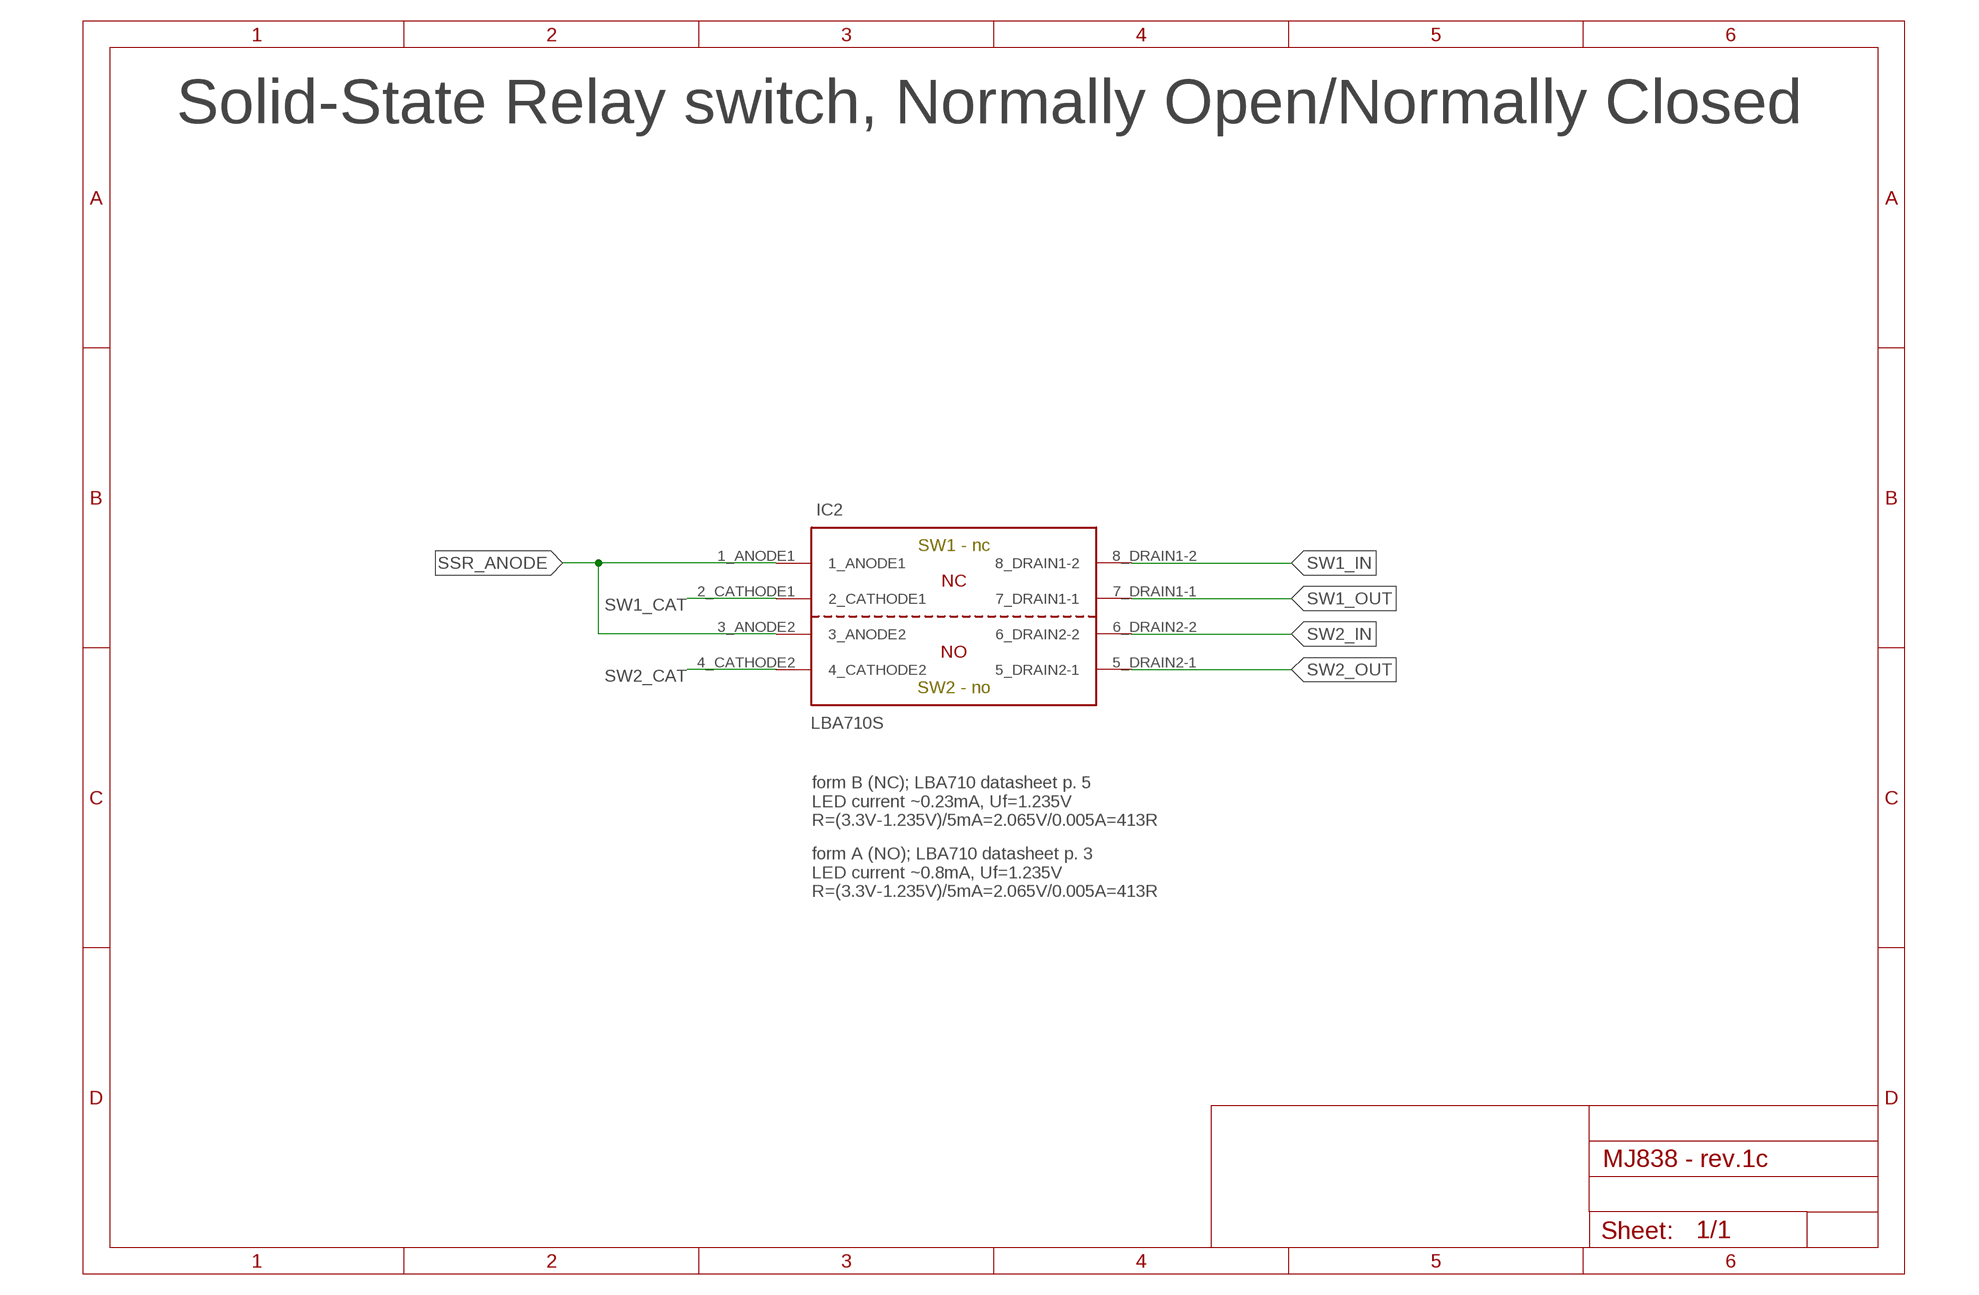
[diagram p7: schematic, module ATM_NOT_USED, sheet 1]

### Parts
IC2  LBA710S  LBA710  [SMD_DIP8]

### Nets
SSR_ANODE [3V3]: IC2.1_ANODE1 IC2.3_ANODE2
SW1_CAT [3V3]: IC2.2_CATHODE1
SW1_IN [BAT+]: IC2.8_DRAIN1-2
SW1_OUT [BAT+]: IC2.7_DRAIN1-1
SW2_CAT [3V3]: IC2.4_CATHODE2
SW2_IN [BAT+]: IC2.6_DRAIN2-2
SW2_OUT [BAT+]: IC2.5_DRAIN2-1

### Notes on the sheet
- Solid-State Relay switch, Normally Open/Normally Closed
- SW1 - nc
- SW2 - no
- form B (NC); LBA710 datasheet p. 5
  LED current ~0.23mA, Uf=1.235V
  R=(3.3V-1.235V)/5mA=2.065V/0.005A=413R
- form A (NO); LBA710 datasheet p. 3
  LED current ~0.8mA, Uf=1.235V
  R=(3.3V-1.235V)/5mA=2.065V/0.005A=413R

### Library data of the parts
IC2 = LxA710 - Solid State Relay Form A-AB:LBA710

## Module SSR_NO/NO
Ports: SSR_ANODE(pwr) SW1_IN(hiz) SW1_OUT(hiz) SW2_IN(hiz) SW2_OUT(hiz) SW1_CAT(in) SW2_CAT(in)
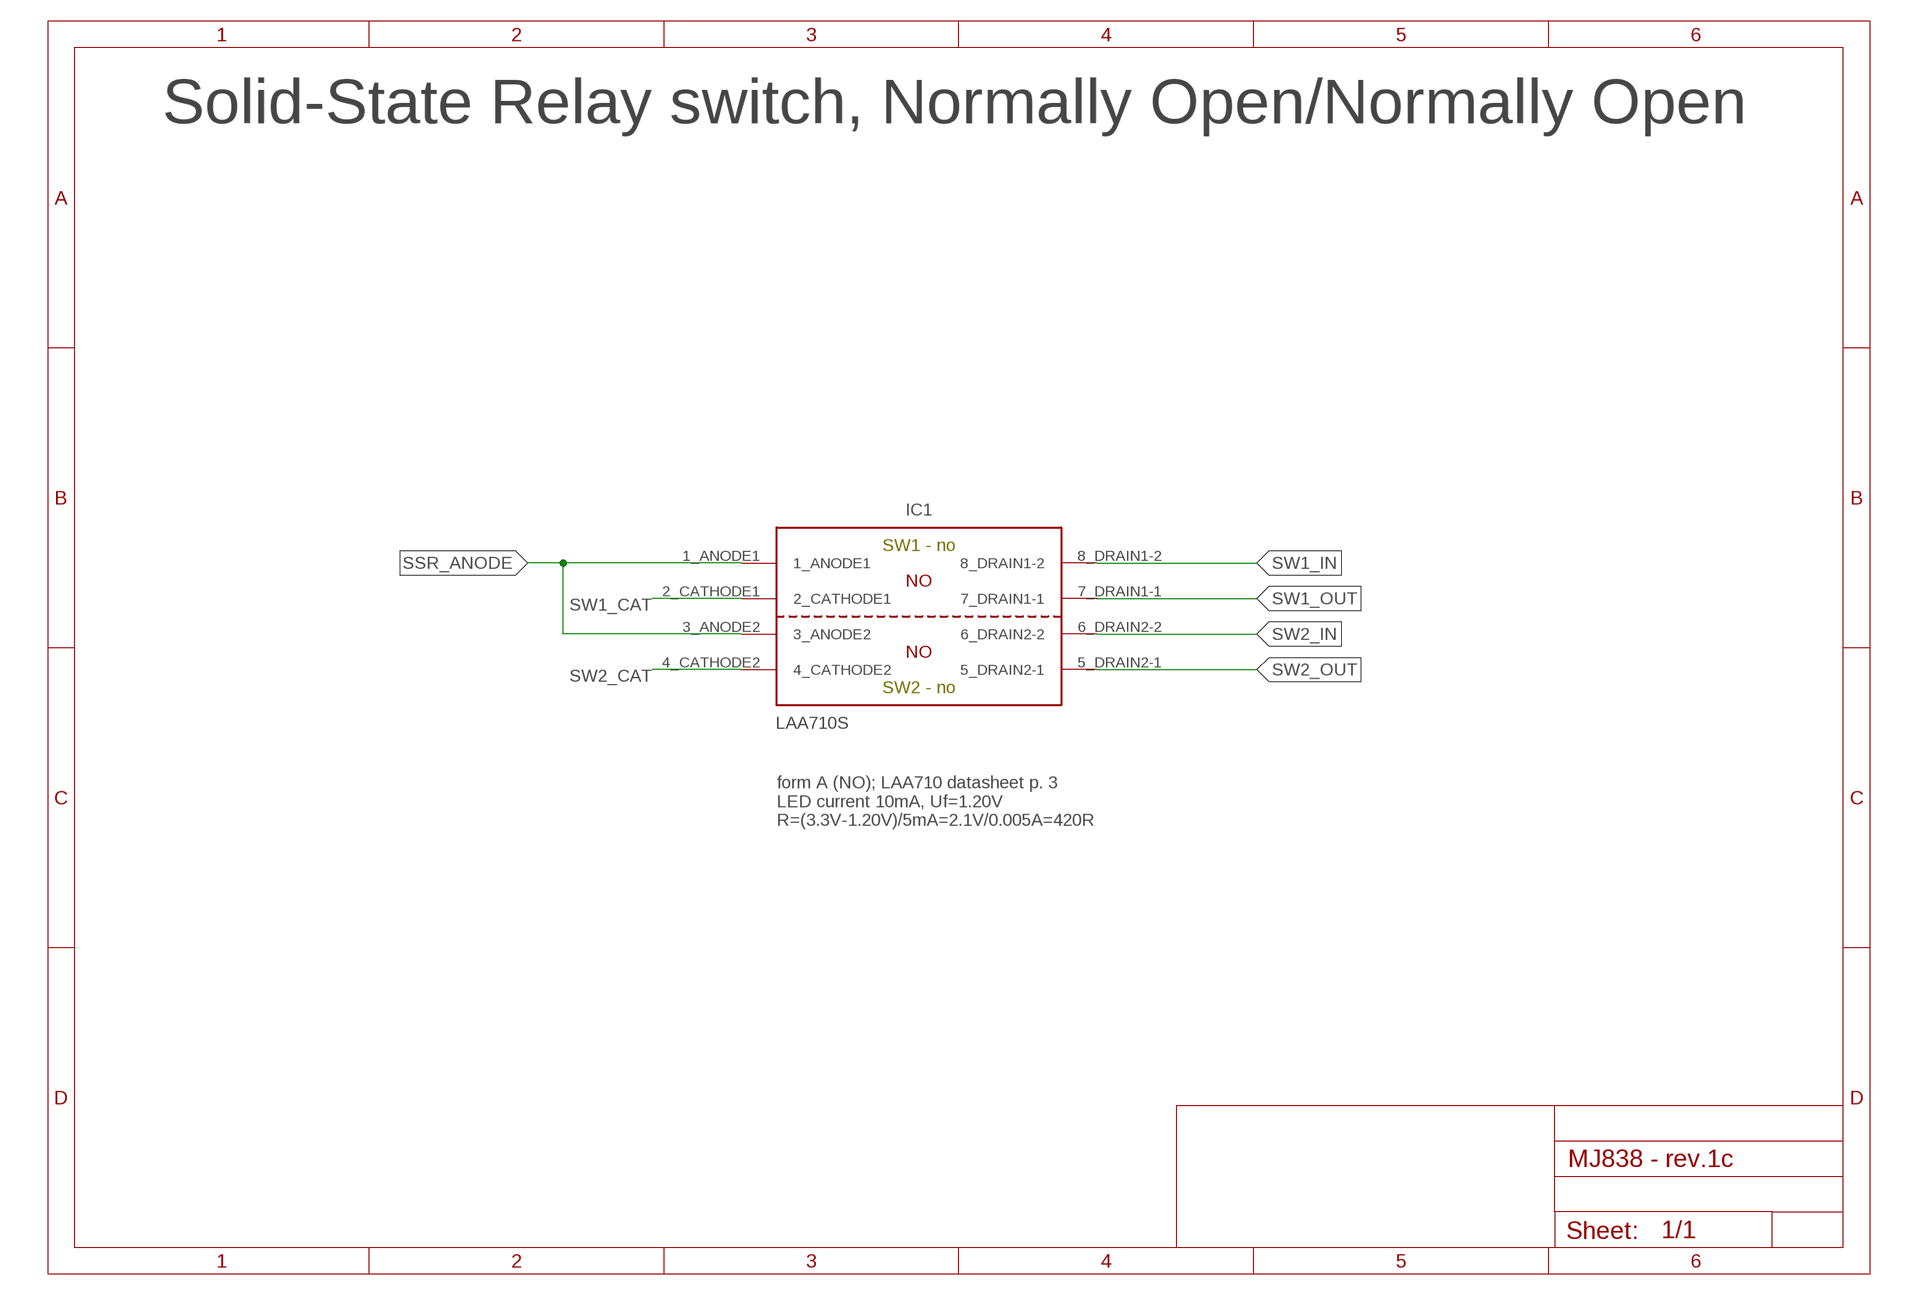
[diagram p8: schematic, module SSR_NO/NO, sheet 1]

### Parts
IC1  LAA710S  LAA710  [SMD_DIP8]

### Nets
SSR_ANODE [3V3]: IC1.1_ANODE1 IC1.3_ANODE2
SW1_CAT [3V3]: IC1.2_CATHODE1
SW1_IN [BAT+]: IC1.8_DRAIN1-2
SW1_OUT [BAT+]: IC1.7_DRAIN1-1
SW2_CAT [3V3]: IC1.4_CATHODE2
SW2_IN [BAT+]: IC1.6_DRAIN2-2
SW2_OUT [BAT+]: IC1.5_DRAIN2-1

### Notes on the sheet
- Solid-State Relay switch, Normally Open/Normally Open
- SW1 - no
- SW2 - no
- form A (NO); LAA710 datasheet p. 3
  LED current 10mA, Uf=1.20V
  R=(3.3V-1.20V)/5mA=2.1V/0.005A=420R

### Library data of the parts
IC1 = LxA710 - Solid State Relay Form A-AB:LAA710

## Module OVP
Ports: N1(pwr) N2(pwr)
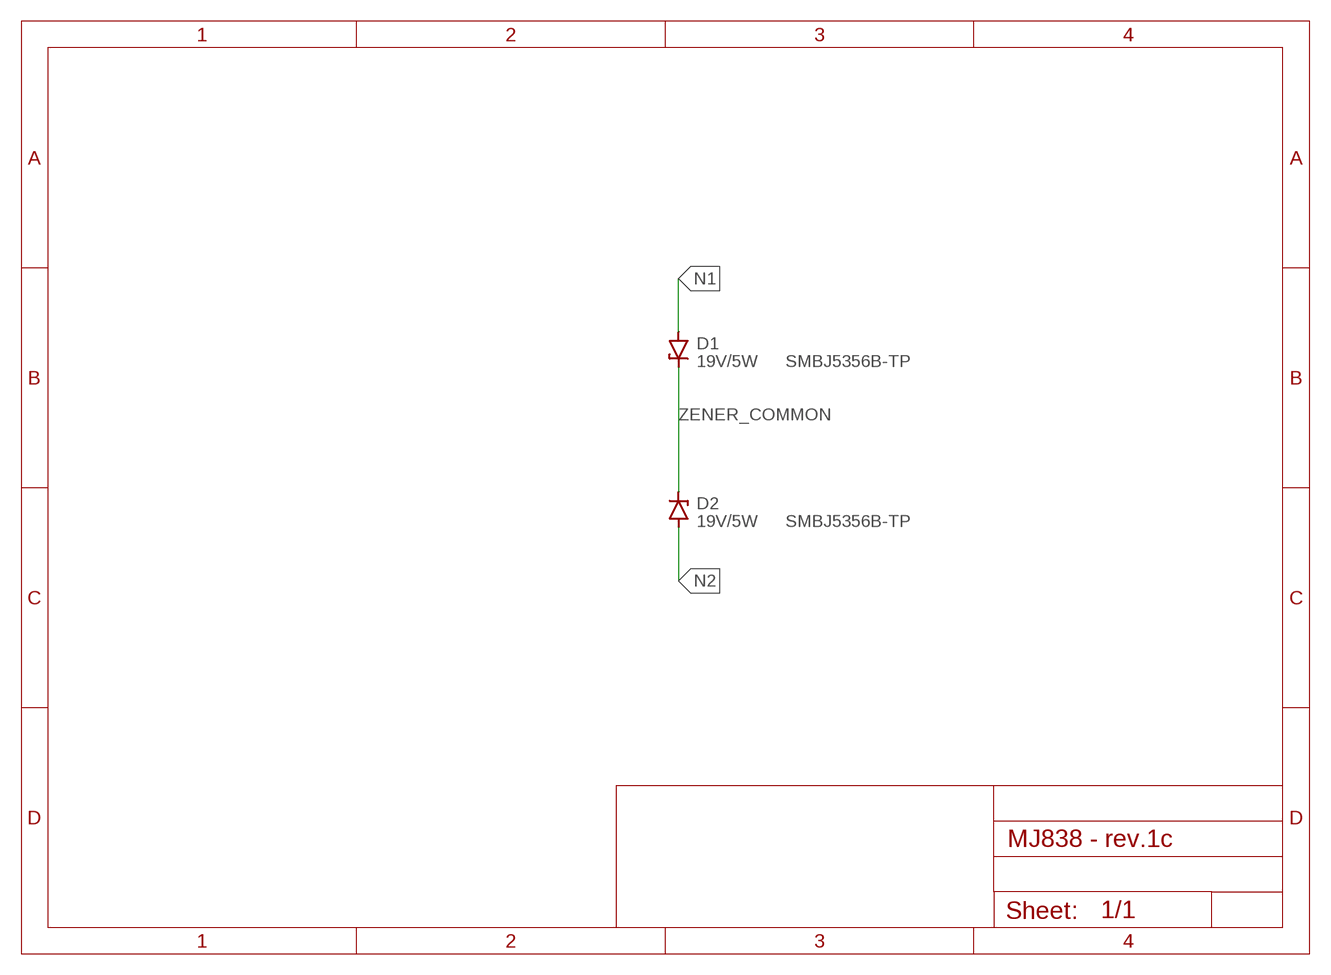
[diagram p9: schematic, module OVP, sheet 1]

### Parts
D1  19V/5W  ZENER-DIODEDO214AA  [DO214AA]
D2  19V/5W  ZENER-DIODEDO214AA  [DO214AA]

### Nets
N1 [Vdynamo]: D1.A
N2 [Vdynamo]: D2.A
ZENER_COMMON [Vdynamo]: D1.C D2.C

### Notes on the sheet
- SMBJ5356B-TP
- SMBJ5356B-TP

### Library data of the parts
D1 D2 = diode:ZENER-DIODE: Z-Diode

## Module DELON
Ports: GND(pwr) SSR_ANODE(pwr) VRECT(pwr) DELON_IN(pwr) !SW_CD!(in)
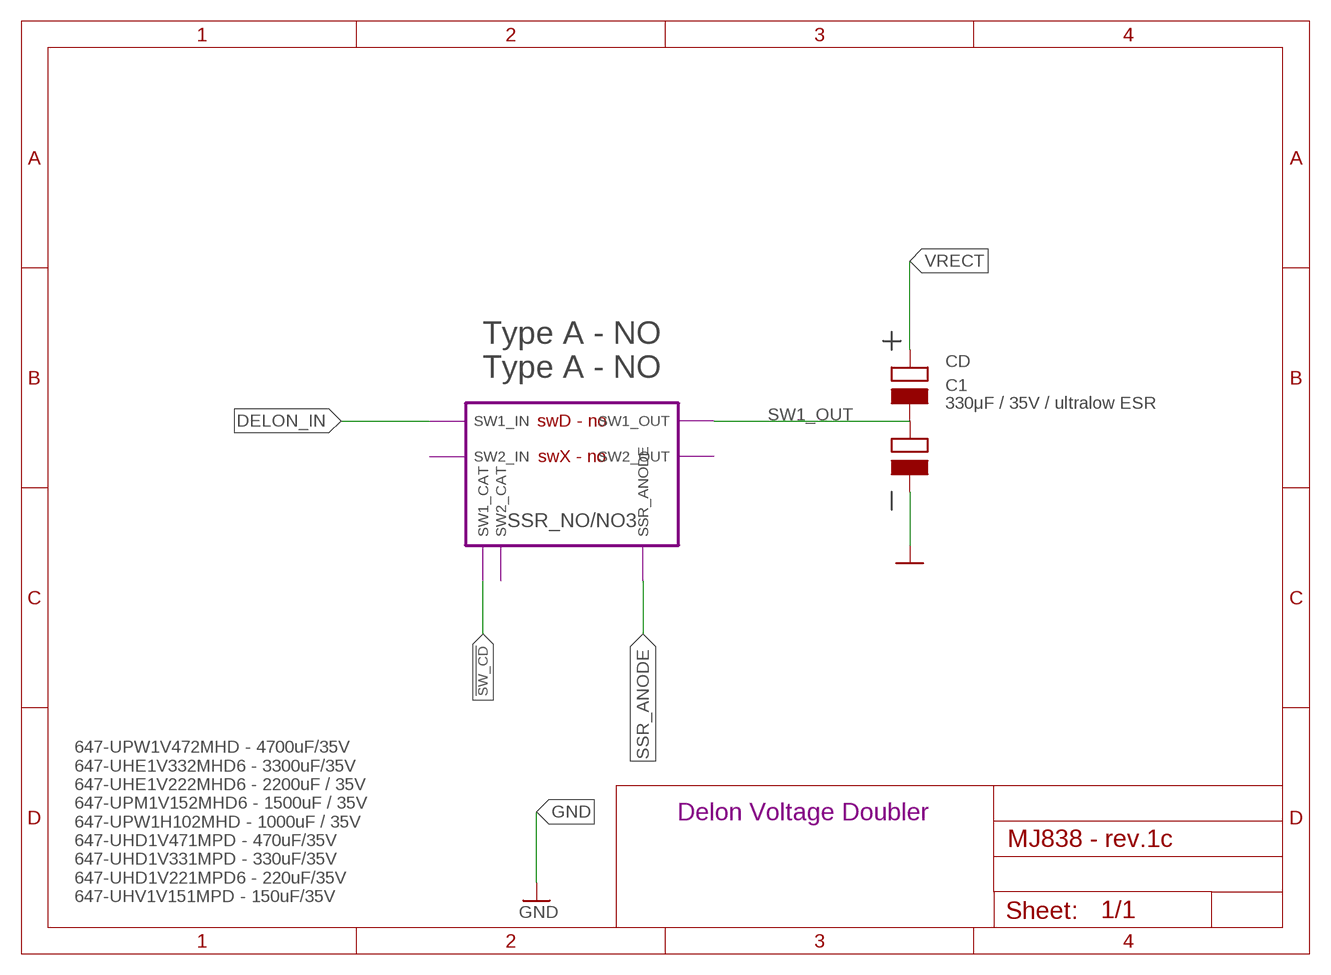
[diagram p10: schematic, module DELON, sheet 1]

### Parts
C1  330μF / 35V / ultralow ESR  C-POL-2S  [TH-2S]

### Module instances
SSR_NO/NO3 = SSR_NO/NO

### Nets
!SW_CD! [signal]: port SSR_NO/NO3.SW1_CAT
DELON_IN [Vac]: port SSR_NO/NO3.SW1_IN
GND: C1.3_NEG(NEG)
SSR_ANODE [3V3]: port SSR_NO/NO3.SSR_ANODE
SW1_OUT [Vac]: C1.2_MID(MID) ; port SSR_NO/NO3.SW1_OUT
VRECT [Vac]: C1.1_POS(POS)

### Notes on the sheet
- Type A - NO
  Type A - NO
- CD
- swD - no
- swX - no
- 647-UPW1V472MHD - 4700uF/35V
  647-UHE1V332MHD6 - 3300uF/35V
  647-UHE1V222MHD6 - 2200uF / 35V
  647-UPM1V152MHD6 - 1500uF / 35V
  647-UPW1H102MHD - 1000uF / 35V
  647-UHD1V471MPD - 470uF/35V
  647-UHD1V331MPD - 330uF/35V
  647-UHD1V221MPD6 - 220uF/35V
  647-UHV1V151MPD - 150uF/35V
- Delon Voltage Doubler

### Library data of the parts
C1 = C-Pol:C-POL-2S

## Module TUNING_CAPS
Ports: SSR_ANODE(pwr) VRECT(pwr) N1(pwr) L1(pwr) L2(pwr) !SW1!(in) !SW2!(in) !SW_CA!(in) !SW_CB!(in) !SW_CC!(in)
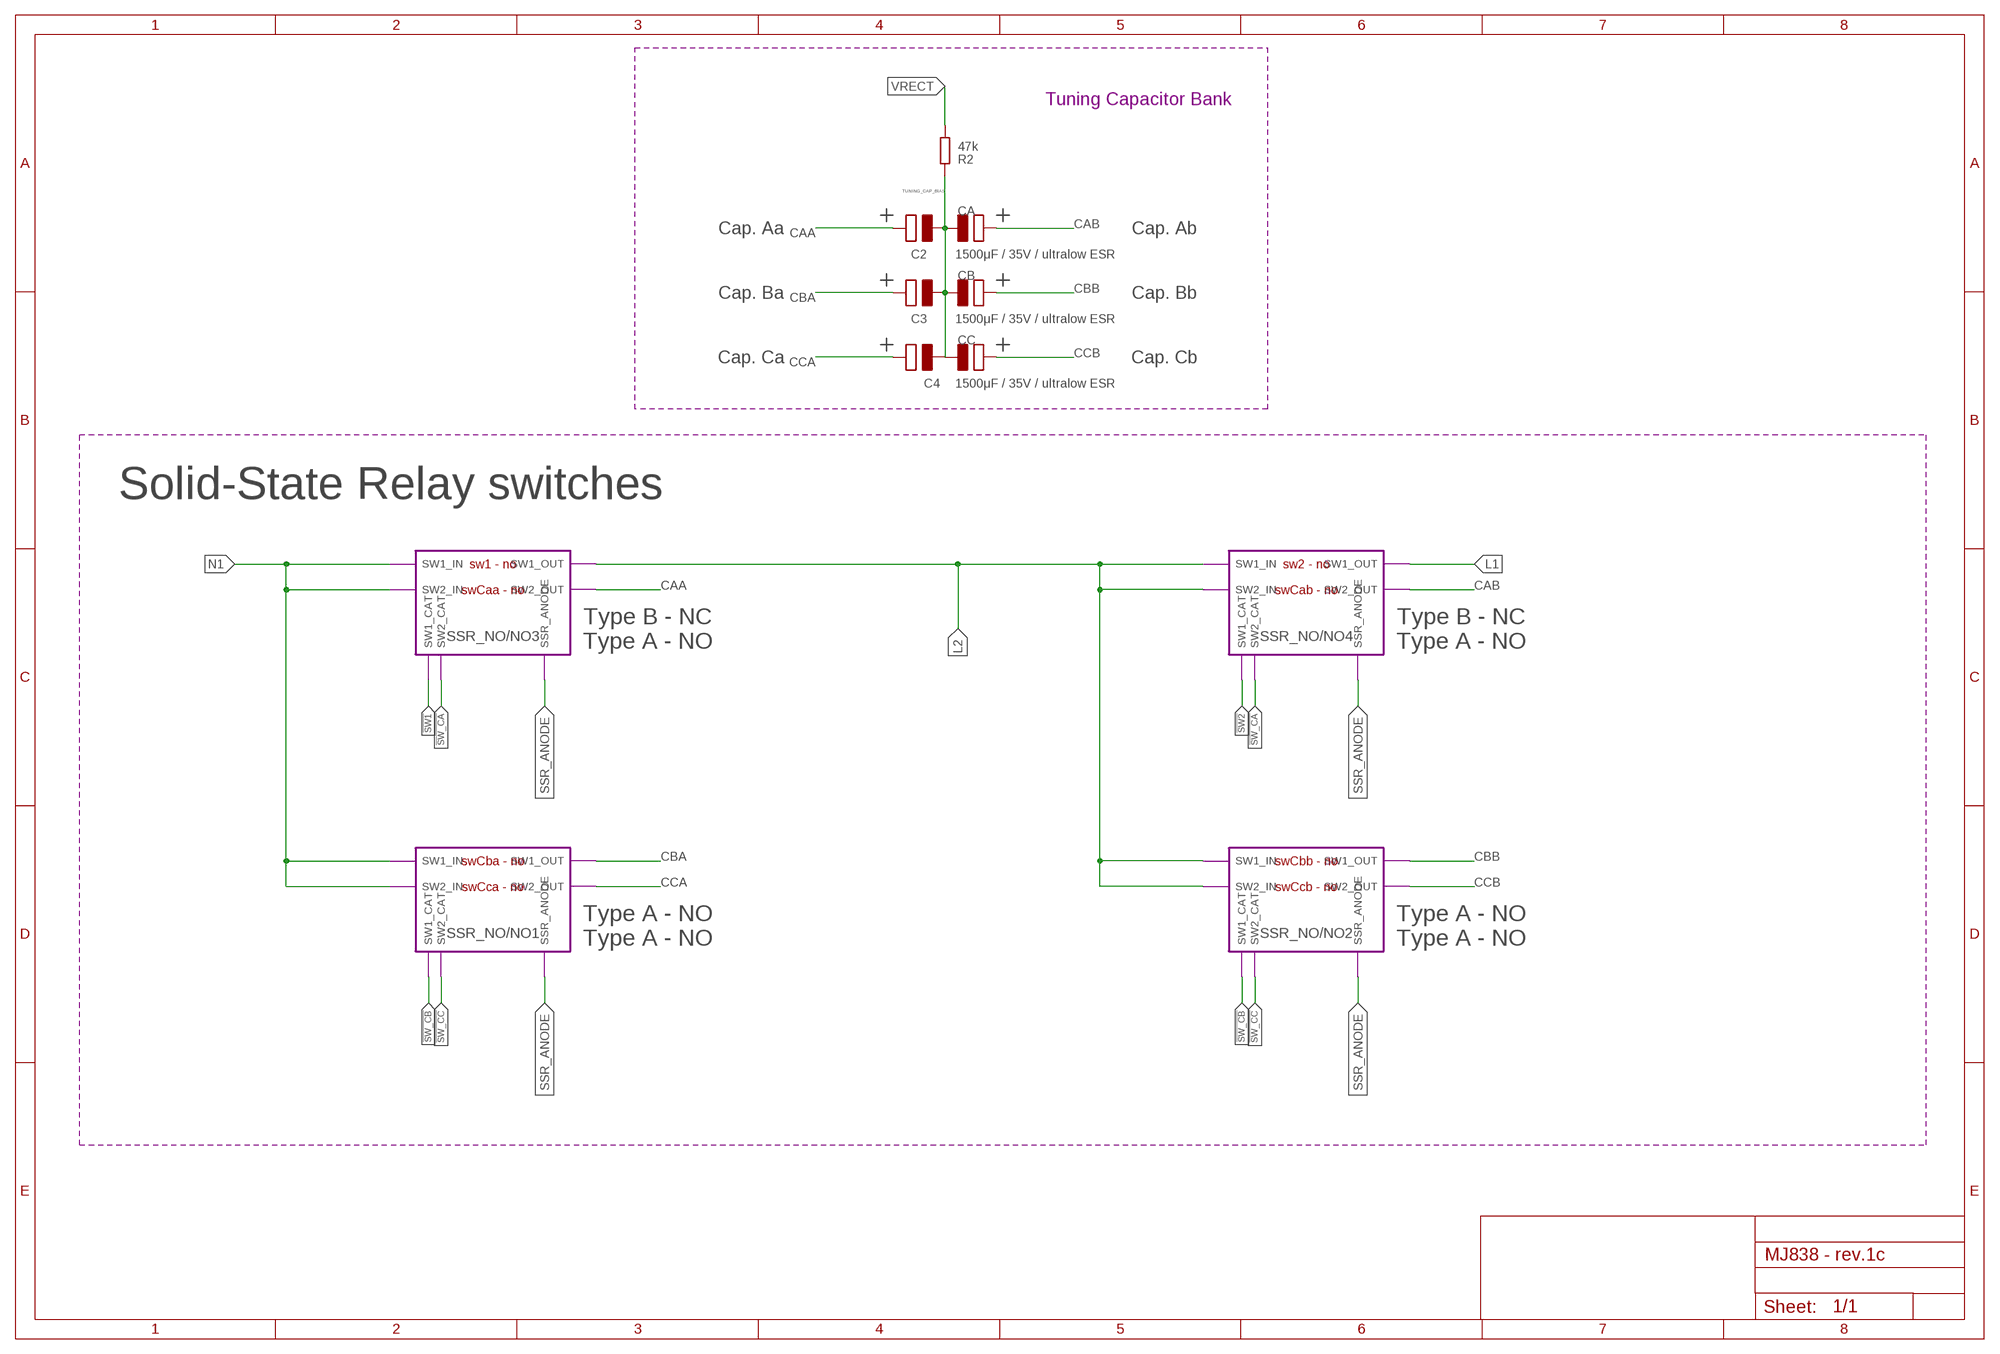
[diagram p11: schematic, module TUNING_CAPS, sheet 1]

### Parts
C2  1500μF / 35V / ultralow ESR  C-POL-2S-BACK-TO-BACK  [TH-2S-BACK-TO-BACK]
C3  1500μF / 35V / ultralow ESR  C-POL-2S-BACK-TO-BACK  [TH-2S-BACK-TO-BACK]
C4  1500μF / 35V / ultralow ESR  C-POL-2S-BACK-TO-BACK  [TH-2S-BACK-TO-BACK]
R2  47k  R-EU_R0805  [R0805]

### Module instances
SSR_NO/NO1 = SSR_NO/NO
SSR_NO/NO2 = SSR_NO/NO
SSR_NO/NO3 = SSR_NO/NO
SSR_NO/NO4 = SSR_NO/NO

### Nets
!SW1! [signal]: port SSR_NO/NO3.SW1_CAT
!SW2! [signal]: port SSR_NO/NO4.SW1_CAT
!SW_CA! [signal]: port SSR_NO/NO3.SW2_CAT SSR_NO/NO4.SW2_CAT
!SW_CB! [signal]: port SSR_NO/NO2.SW1_CAT SSR_NO/NO1.SW1_CAT
!SW_CC! [signal]: port SSR_NO/NO2.SW2_CAT SSR_NO/NO1.SW2_CAT
CAA [Vac]: C2.1_C ; port SSR_NO/NO3.SW2_OUT
CAB [Vac]: C2.3_C(2_C) ; port SSR_NO/NO4.SW2_OUT
CBA [Vac]: C3.1_C ; port SSR_NO/NO1.SW1_OUT
CBB [Vac]: C3.3_C(2_C) ; port SSR_NO/NO2.SW1_OUT
CCA [Vac]: C4.1_C ; port SSR_NO/NO1.SW2_OUT
CCB [Vac]: C4.3_C(2_C) ; port SSR_NO/NO2.SW2_OUT
L1 [Vac]: port SSR_NO/NO4.SW1_OUT
L2 [Vac]: port SSR_NO/NO2.SW1_IN SSR_NO/NO2.SW2_IN SSR_NO/NO3.SW1_OUT SSR_NO/NO4.SW1_IN SSR_NO/NO4.SW2_IN
N1 [Vdynamo]: port SSR_NO/NO1.SW1_IN SSR_NO/NO1.SW2_IN SSR_NO/NO3.SW1_IN SSR_NO/NO3.SW2_IN
SSR_ANODE [3V3]: port SSR_NO/NO3.SSR_ANODE SSR_NO/NO4.SSR_ANODE SSR_NO/NO1.SSR_ANODE SSR_NO/NO2.SSR_ANODE
TUNING_CAP_BIAS [Vac]: C2.2_MID(MID) C3.2_MID(MID) C4.2_MID(MID) R2.1
VRECT [Vac]: R2.2

### Notes on the sheet
- Tuning Capacitor Bank
- CA
- Cap. Aa | Cap. Ab
- CB
- Cap. Ba | Cap. Bb
- CC
- Cap. Ca | Cap. Cb
- Solid-State Relay switches
- sw1 - no | sw2 - no
- swCaa - no | swCab - no
- Type B - NC
  Type A - NO
- Type B - NC
  Type A - NO
- swCba - no | swCbb - no
- swCca - no | swCcb - no
- Type A - NO
  Type A - NO
- Type A - NO
  Type A - NO

### Library data of the parts
C2-C4 = C-Pol:C-POL-2S-BACK-TO-BACK
R2 = rcl:R-EU_: RESISTOR, European symbol; SPICEPREFIX: R

## Module GRAETZ+DELON
Ports: N1(pwr) N2(pwr) GND(pwr) VRECT(pwr) 3V3(pwr) SCL(in) SDA(io) !RESET!(in)
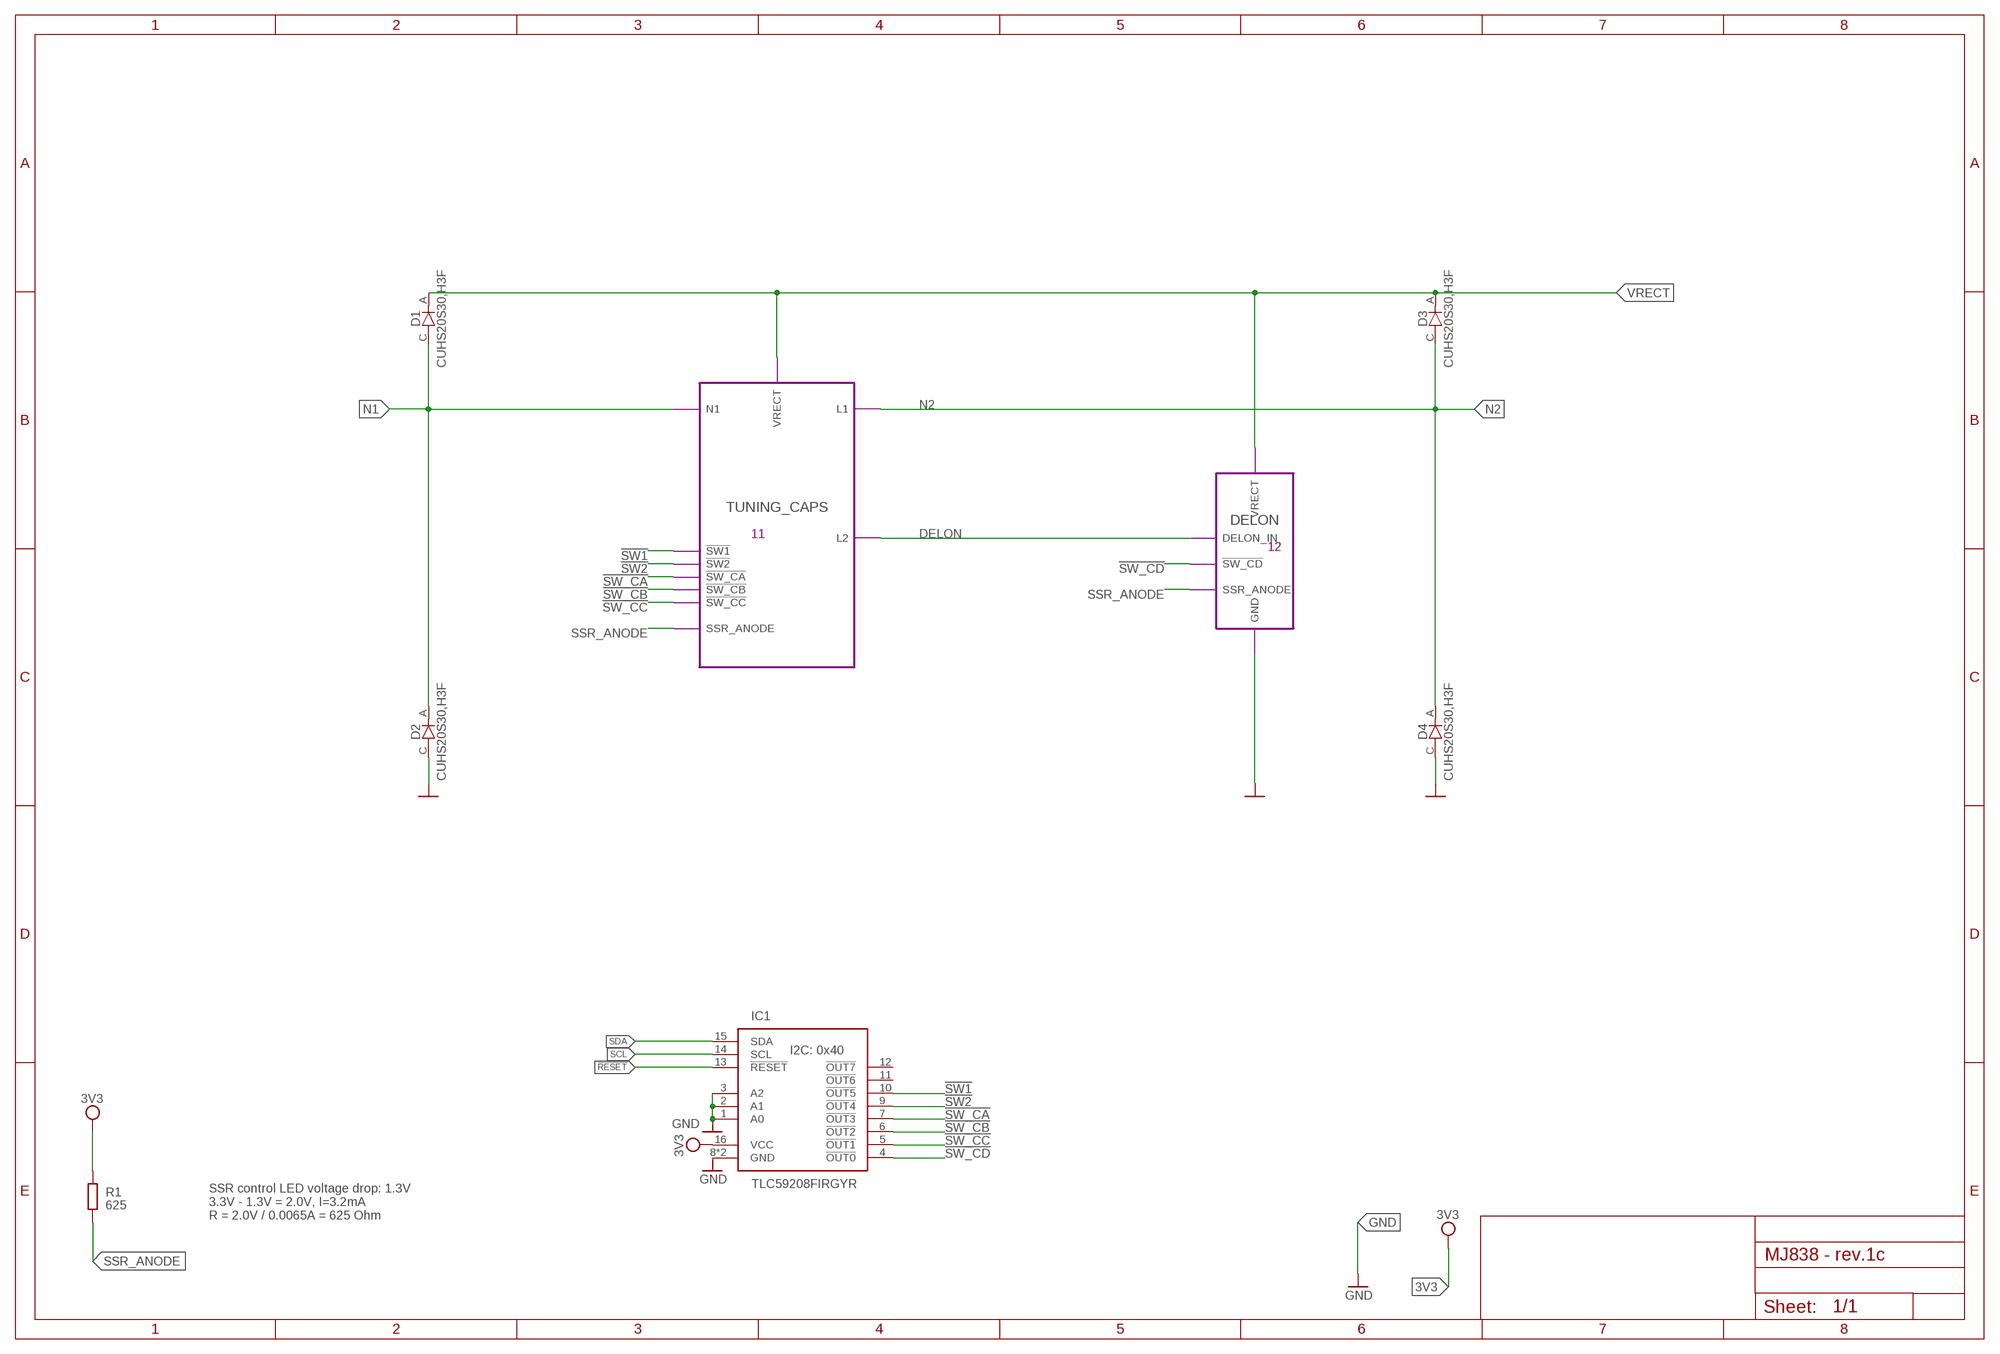
[diagram p12: schematic, module GRAETZ+DELON, sheet 1]

### Parts
D1  CUHS20S30,H3F  CUHS20S30  [US2H]
D2  CUHS20S30,H3F  CUHS20S30  [US2H]
D3  CUHS20S30,H3F  CUHS20S30  [US2H]
D4  CUHS20S30,H3F  CUHS20S30  [US2H]
IC1  TLC59208FIRGYR  TLC59208F  [VQFN16]
R1  625  R-EU_R0805  [R0805]

### Module instances
DELON = DELON
TUNING_CAPS = TUNING_CAPS

### Nets
3V3 [Vdc]: IC1.16(VCC) R1.2
!RESET! [signal]: IC1.13(!RESET!)
!SW1! [3V3]: IC1.10(!OUT5!) ; port TUNING_CAPS.!SW1!
!SW2! [3V3]: IC1.9(!OUT4!) ; port TUNING_CAPS.!SW2!
!SW_CA! [3V3]: IC1.7(!OUT3!) ; port TUNING_CAPS.!SW_CA!
!SW_CB! [3V3]: IC1.6(!OUT2!) ; port TUNING_CAPS.!SW_CB!
!SW_CC! [3V3]: IC1.5(!OUT1!) ; port TUNING_CAPS.!SW_CC!
!SW_CD! [3V3]: IC1.4(!OUT0!) ; port DELON.!SW_CD!
DELON [Vac]: port TUNING_CAPS.L2 DELON.DELON_IN
GND: D2.C D4.C IC1.1(A0) IC1.2(A1) IC1.3(A2) IC1.8(GND) IC1.17(GND) ; port DELON.GND
N1 [Vdynamo]: D1.C D2.A ; port TUNING_CAPS.N1
N2 [Vdynamo]: D3.C D4.A ; port TUNING_CAPS.L1
SCL [signal]: IC1.14(SCL)
SDA [signal]: IC1.15(SDA)
SSR_ANODE [3V3]: R1.1 ; port DELON.SSR_ANODE TUNING_CAPS.SSR_ANODE
VRECT [Vac]: D1.A D3.A ; port TUNING_CAPS.VRECT DELON.VRECT
Unconnected: IC1.11(!OUT6!) IC1.12(!OUT7!)

### Notes on the sheet
- 11
- 12
- I2C: 0x40
- SSR control LED voltage drop: 1.3V
  3.3V - 1.3V = 2.0V, I=3.2mA
  R = 2.0V / 0.0065A = 625 Ohm

### Library data of the parts
D1-D4 = CUHS20S30 - Schottky Barrier Diode:CUHS20S30
IC1 = TLC59208F - LED Driver:TLC59208F
R1 = rcl:R-EU_: RESISTOR, European symbol; SPICEPREFIX: R

## Module M-RAM
Ports: GND(pwr) 3V3(pwr) !CS!(in) CLK(in) SI/IO0(io) SO/IO1(io) !WP!/IO2(io) IO3(io)
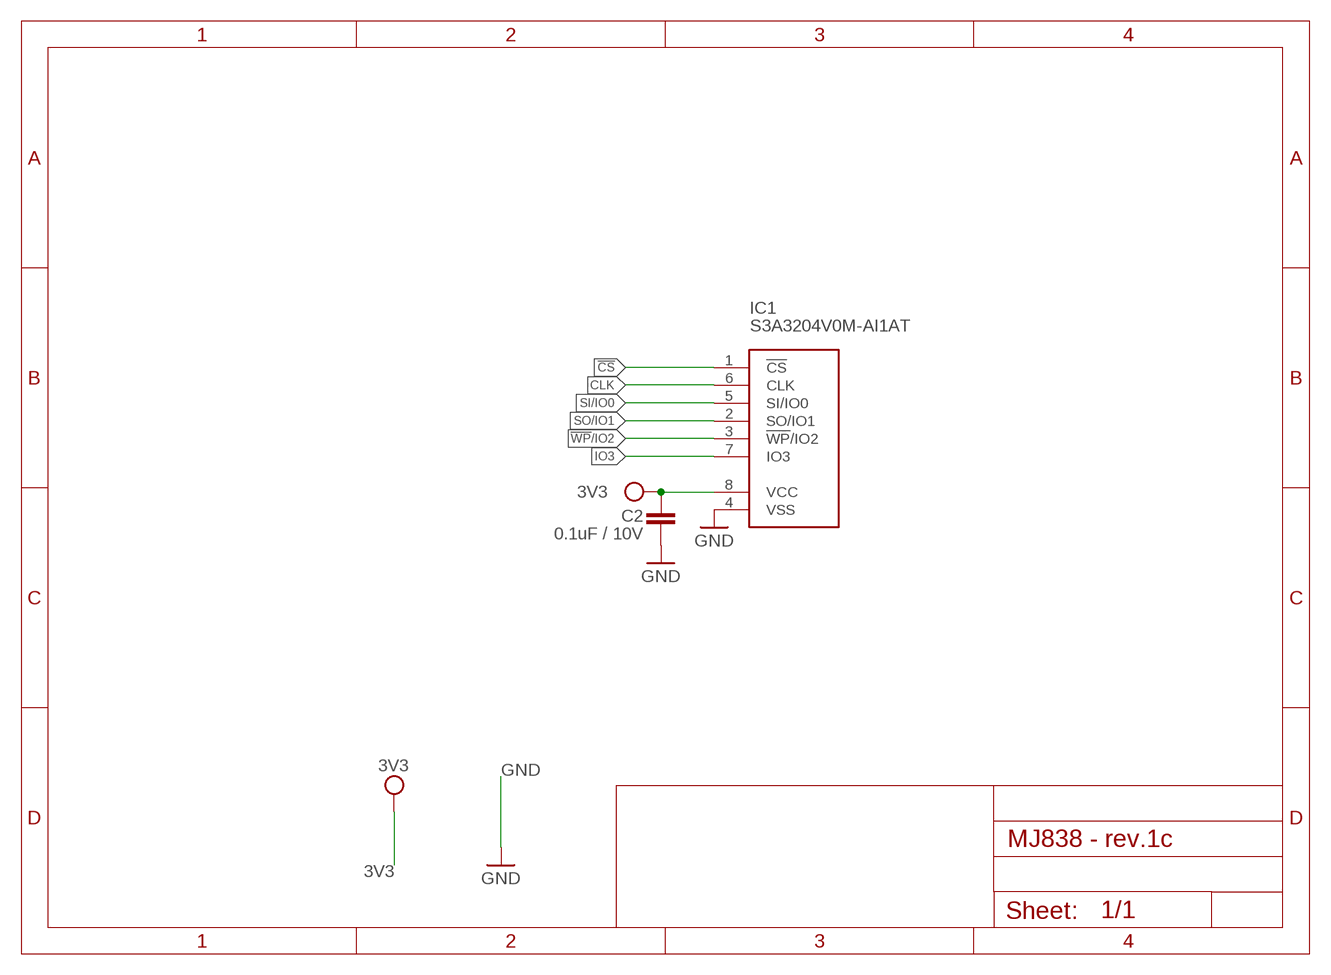
[diagram p13: schematic, module M-RAM, sheet 1]

### Parts
C2  0.1uF / 10V  C-EUC0402  [C0402]
IC1  S3A3204V0M-AI1AT  S3A3204V0M  [SOIC08]

### Nets
3V3 [3V3]: C2.2 IC1.8(VCC)
!CS! [signal]: IC1.1(!CS!)
!WP!/IO2 [signal]: IC1.3(!WP!/IO2)
CLK [signal]: IC1.6(CLK)
GND: C2.1 IC1.4(VSS)
IO3 [signal]: IC1.7(IO3)
SI/IO0 [signal]: IC1.5(SI/IO0)
SO/IO1 [signal]: IC1.2(SO/IO1)

### Library data of the parts
C2 = rcl:C-EU: CAPACITOR, European symbol; MFRNO: GRM155R62A104KE14J; SPICEPREFIX: C
IC1 = S3A3204V0M - MRAM:S3A3204V0M

## Module HUMIDITY
Ports: GND(pwr) 3V3(pwr) SCL(in) SDA(io)
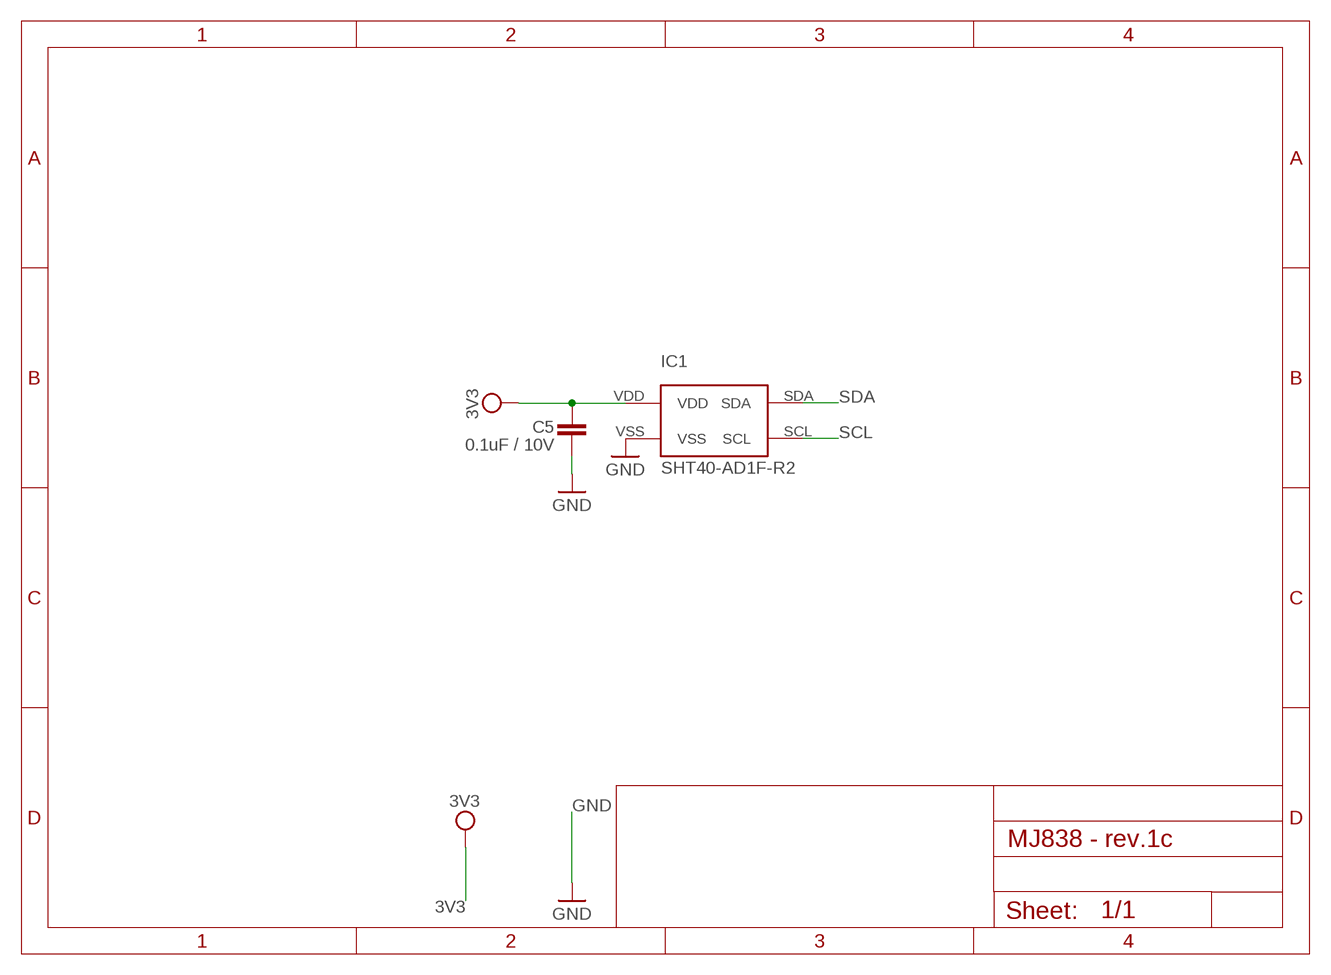
[diagram p14: schematic, module HUMIDITY, sheet 1]

### Parts
C5  0.1uF / 10V  C-EUC0402  [C0402]
IC1  SHT40-AD1F-R2  SHT40  [SMD]

### Nets
3V3 [3V3]: C5.1 IC1.VDD
GND: C5.2 IC1.VSS
SCL [signal]: IC1.SCL
SDA [signal]: IC1.SDA

### Library data of the parts
C5 = rcl:C-EU: CAPACITOR, European symbol; SPICEPREFIX: C
IC1 = SHT40-AD1F - Humidity Sensor:SHT40

## Module INA219
Ports: GND(pwr) 3V3(pwr) A0(hiz) A1(hiz) IN+(in) IN-(out) SCL(in) SDA(io)
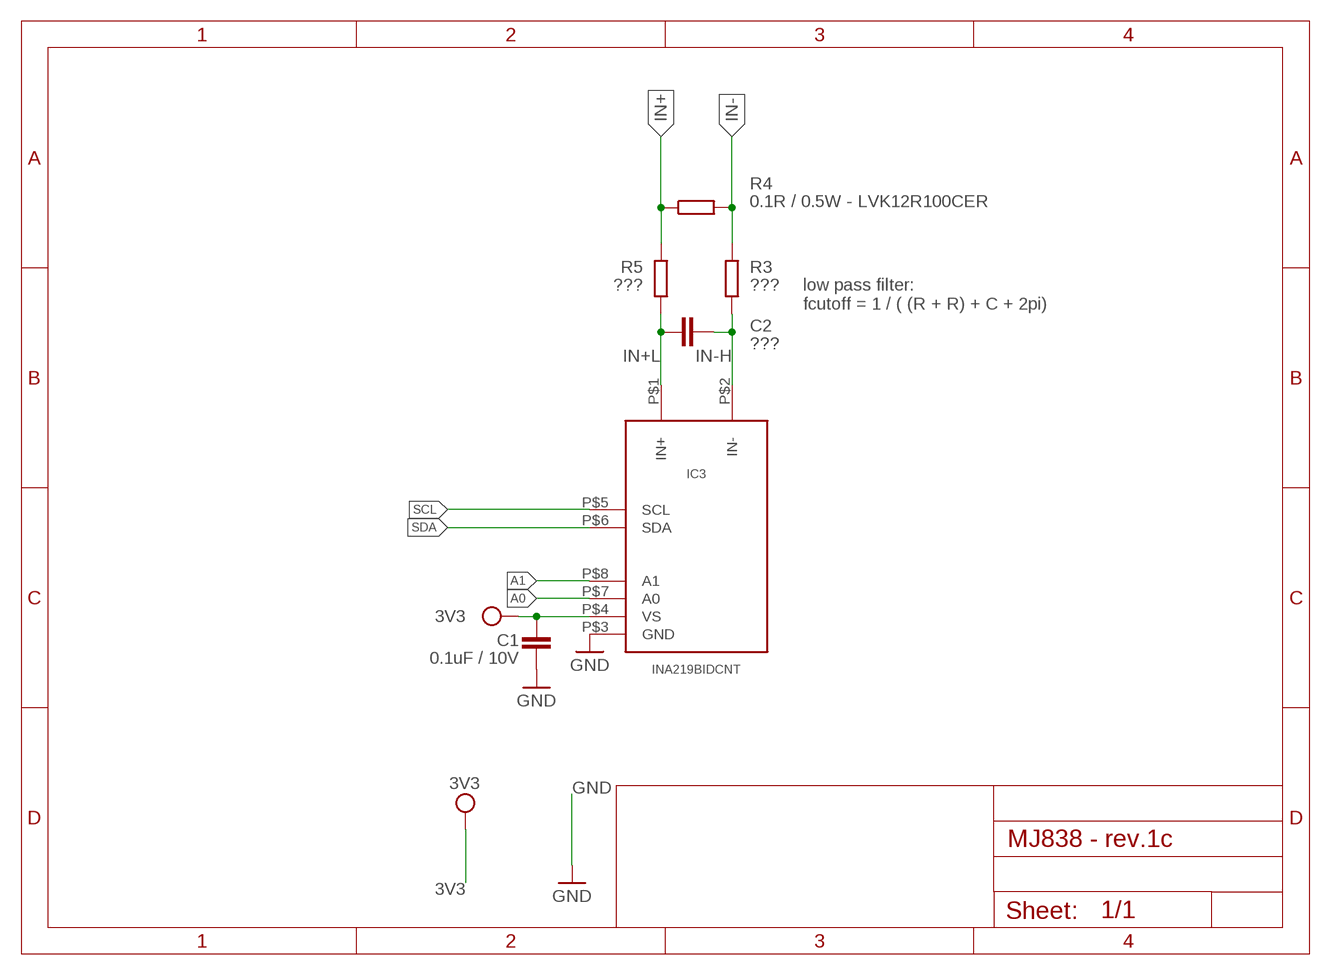
[diagram p15: schematic, module INA219, sheet 1]

### Parts
C1  0.1uF / 10V  C-EUC0402  [C0402]
C2  ???  C-EUC0402  [C0402]
IC3  INA219BIDCNT  INA219  [SOT-23-8]
R3  ???  R-EU_R0402  [R0402]
R4  0.1R / 0.5W - LVK12R100CER  R-EU_R1206  [R1206]
R5  ???  R-EU_R0402  [R0402]

### Nets
3V3 [3V3]: C1.1 IC3.P$4(VS)
A0 [signal]: IC3.P$7(A0)
A1 [signal]: IC3.P$8(A1)
GND: C1.2 IC3.P$3(GND)
IN+ [signal]: R4.1 R5.2
IN+L [signal]: C2.1 IC3.P$1(IN+) R5.1
IN- [signal]: R3.2 R4.2
IN-H [signal]: C2.2 IC3.P$2(IN-) R3.1
SCL [signal]: IC3.P$5(SCL)
SDA [signal]: IC3.P$6(SDA)

### Notes on the sheet
- low pass filter:
  fcutoff = 1 / ( (R + R) + C + 2pi)

### Library data of the parts
C1 C2 = rcl:C-EU: CAPACITOR, European symbol; SPICEPREFIX: C
IC3 = INA219 - I2C Current & Power Monitor:INA219
R3-R5 = rcl:R-EU_: RESISTOR, European symbol; SPICEPREFIX: R

## Module PHASE_SHIFT
Ports: GND(pwr) 3V3(pwr) OUT(out) IN+(pwr) IN-(pwr)
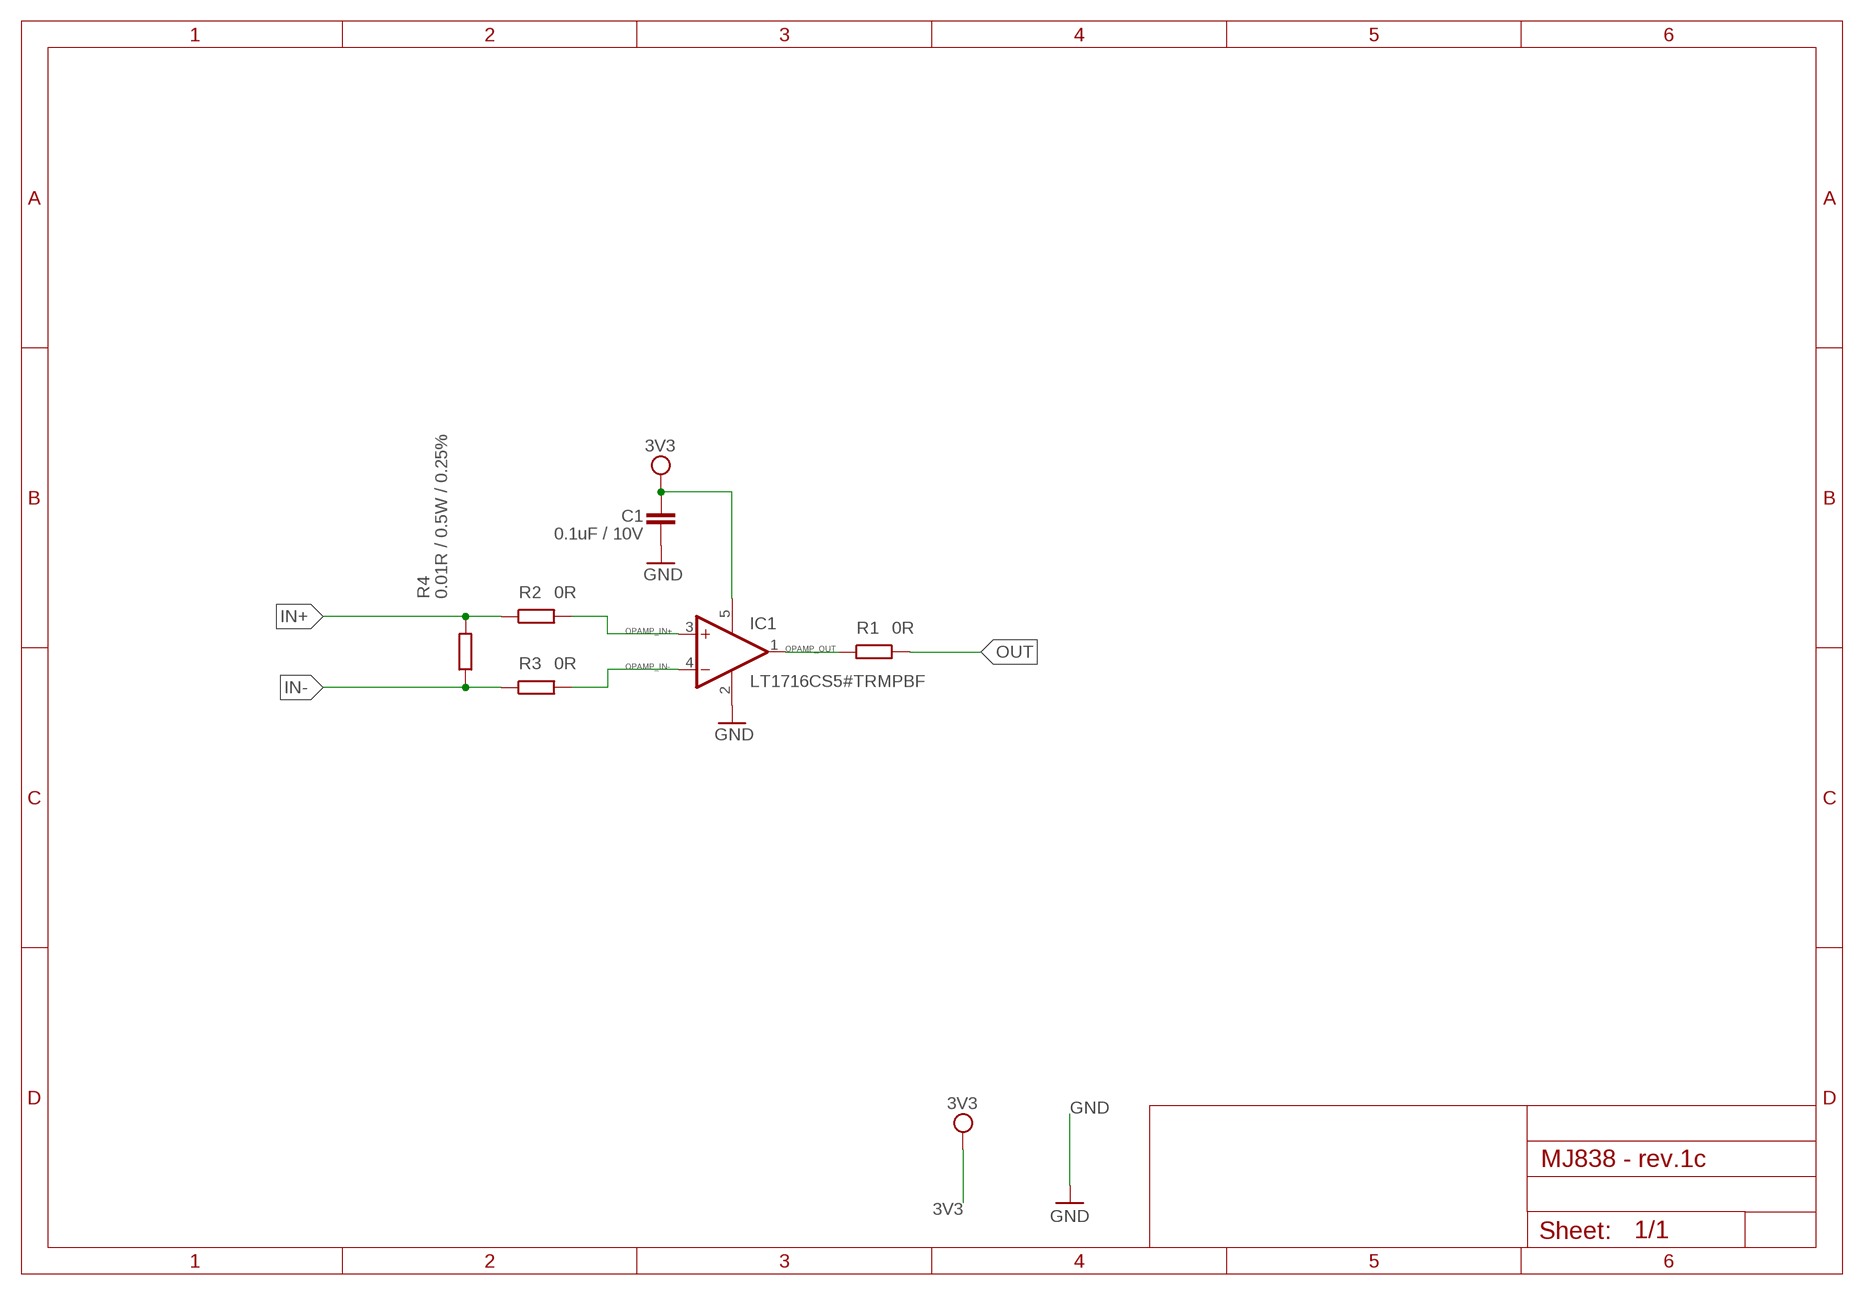
[diagram p16: schematic, module PHASE_SHIFT, sheet 1]

### Parts
C1  0.1uF / 10V  C-EUC0402  [C0402]
IC1  LT1716CS5#TRMPBF  OPA344N-SOT23  [SOT23-5]
R1  0R  R-EU_R0603  [R0603]
R2  0R  R-EU_R0603  [R0603]
R3  0R  R-EU_R0603  [R0603]
R4  0.01R / 0.5W / 0.25%  R-EU_R1206  [R1206]

### Nets
3V3 [3V3]: C1.2 IC1.5(V+)
GND: C1.1 IC1.2(V-)
IN+ [signal]: R2.1 R4.2
IN- [signal]: R3.1 R4.1
OPAMP_IN+ [signal]: IC1.3(+IN) R2.2
OPAMP_IN- [signal]: IC1.4(-IN) R3.2
OPAMP_OUT [signal]: IC1.1(OUT) R1.1
OUT [signal]: R1.2

### Library data of the parts
C1 = rcl:C-EU: CAPACITOR, European symbol; SPICEPREFIX: C
IC1 = linear:OPA*-SOT23: Single Operational Amplifier Low Power, Single-Supply, Rail-To-Rail Operational Amplifier Source: http://focus.ti.com/lit/ds/symlink/opa2345.pdf
R1-R4 = rcl:R-EU_: RESISTOR, European symbol; SPICEPREFIX: R

## Module SD_CARD
Ports: GND(pwr) 3V3(pwr) DET(hiz) CLK(in) CMD(io) DATA0(io) DATA1(io) DATA2(io) DATA3(io)
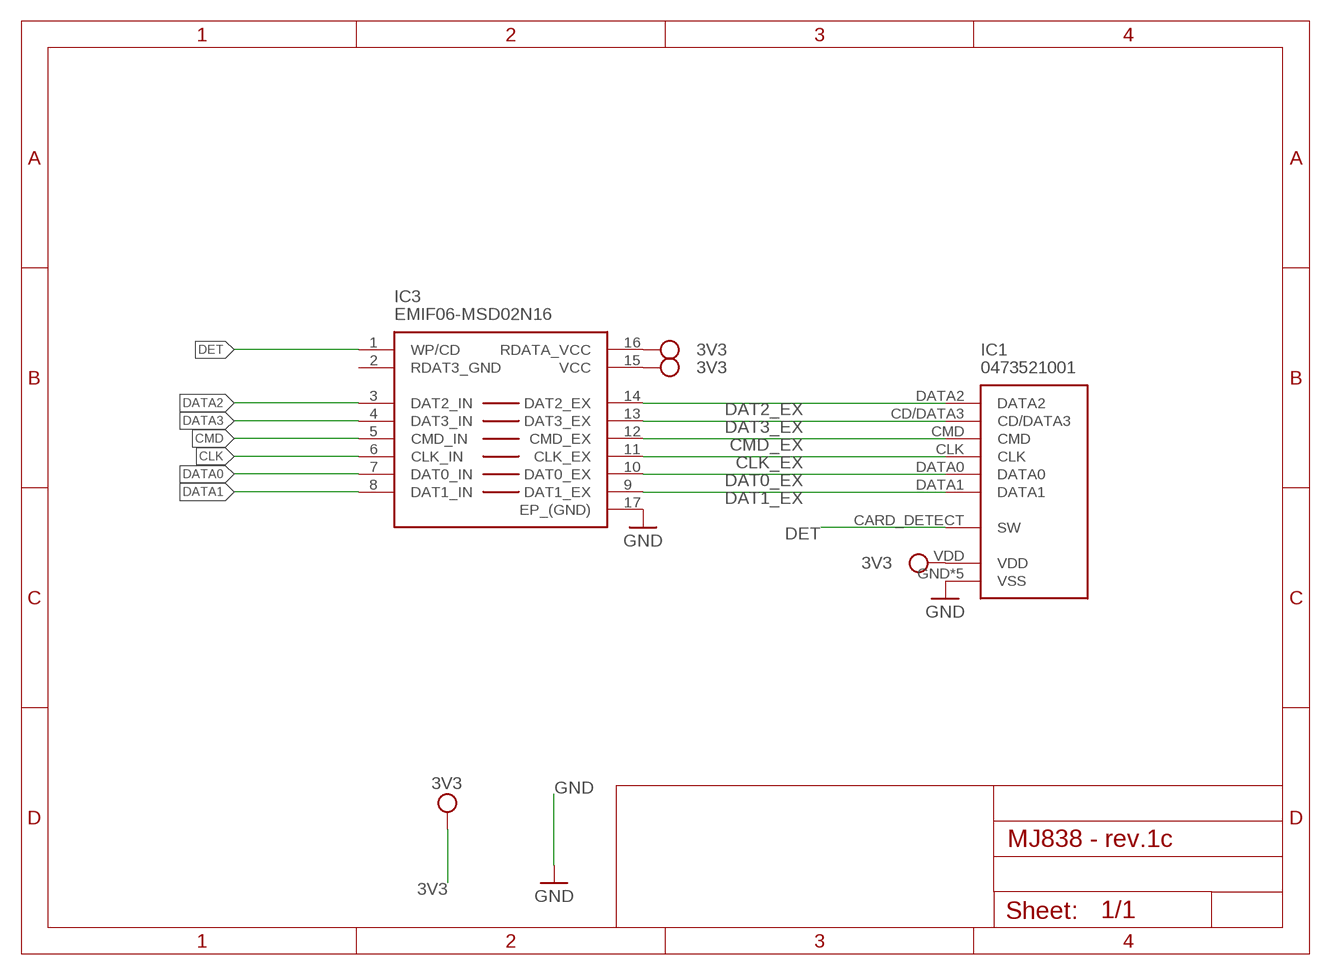
[diagram p17: schematic, module SD_CARD, sheet 1]

### Parts
IC1  0473521001  47352-1001  [SMD]
IC3  EMIF06-MSD02N16  [MICRO_QFN]

### Nets
3V3 [3V3]: IC1.VDD IC3.15(VCC) IC3.16(RDATA_VCC)
CLK [signal]: IC3.6(CLK_IN)
CLK_EX [signal]: IC1.CLK IC3.11(CLK_EX)
CMD [signal]: IC3.5(CMD_IN)
CMD_EX [signal]: IC1.CMD IC3.12(CMD_EX)
DAT0_EX [signal]: IC1.DATA0 IC3.10(DAT0_EX)
DAT1_EX [signal]: IC1.DATA1 IC3.9(DAT1_EX)
DAT2_EX [signal]: IC1.DATA2 IC3.14(DAT2_EX)
DAT3_EX [signal]: IC1.CD/DATA3 IC3.13(DAT3_EX)
DATA0 [signal]: IC3.7(DAT0_IN)
DATA1 [signal]: IC3.8(DAT1_IN)
DATA2 [signal]: IC3.3(DAT2_IN)
DATA3 [signal]: IC3.4(DAT3_IN)
DET [signal]: IC1.CARD_DETECT(SW) IC3.1(WP/CD)
GND: IC1.GND(VSS) IC1.S1(VSS) IC1.S2(VSS) IC1.S3(VSS) IC1.S4(VSS) IC3.17(EP_(GND))
Unconnected: IC3.2(RDAT3_GND)

### Library data of the parts
IC1 = 47352-1001 - SD Card Holder:47352-1001: Check availability <https://pricing.snapeda.com/parts/47352-1001/Molex/view-part?ref=eda>
IC3 = EMIF06-MSD02N16 - ESD Protection - SD Card:EMIF06-MSD02N16: Check availability <https://pricing.snapeda.com/parts/EMIF06-MSD02N16/STMicroelectronics/view-part?ref=eda>

## Module ACCELEROMETER
Ports: GND(pwr) 3V3(pwr) SDA(io) SCL(in) INT1(out) INT2(out)
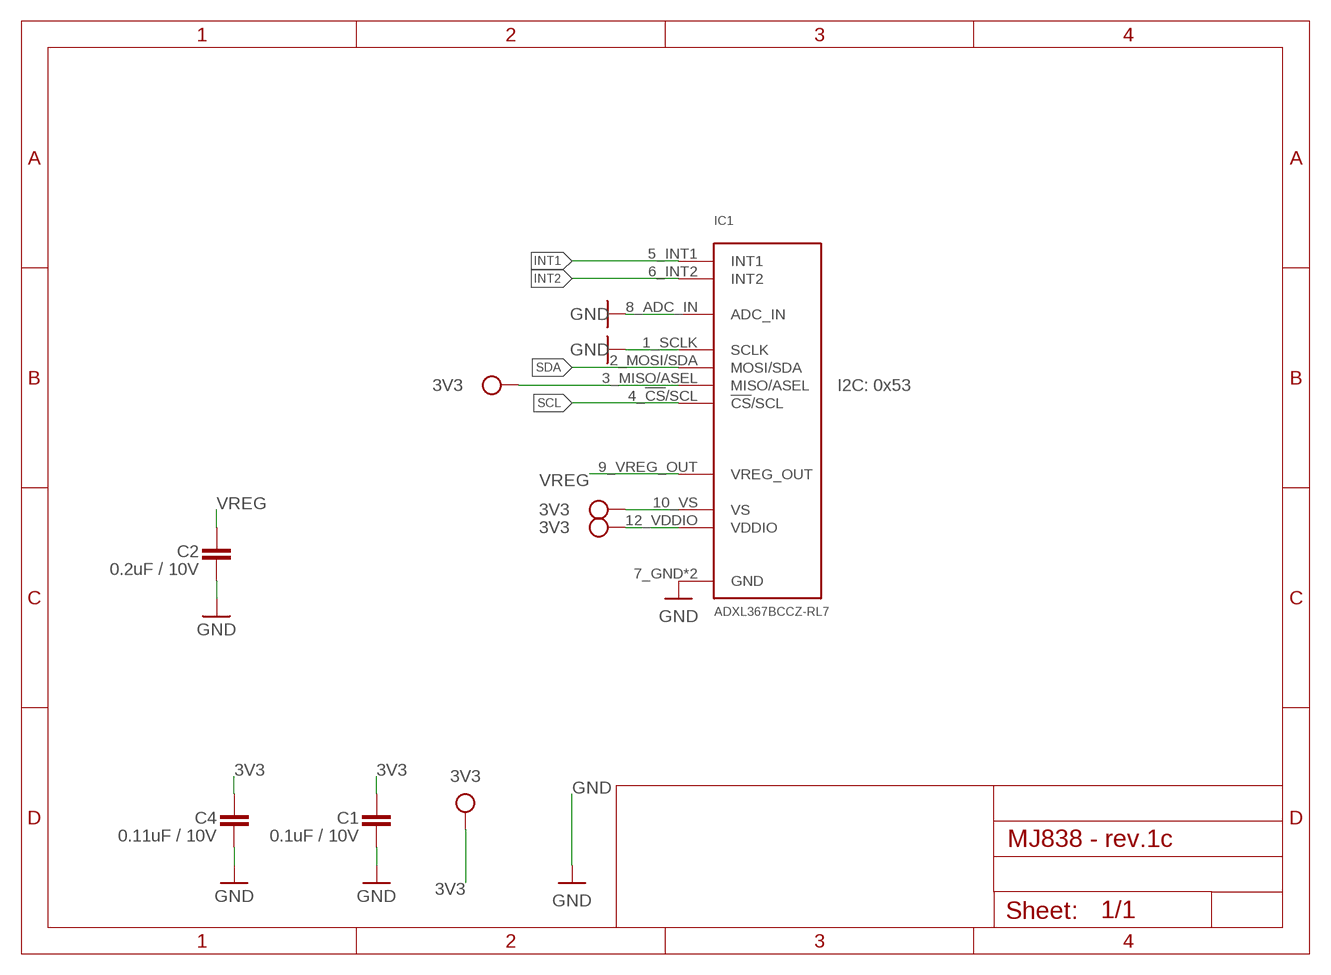
[diagram p18: schematic, module ACCELEROMETER, sheet 1]

### Parts
C1  0.1uF / 10V  C-EUC0402  [C0402]
C2  0.2uF / 10V  C-EUC0402  [C0402]
C4  0.11uF / 10V  C-EUC0402  [C0402]
IC1  ADXL367BCCZ-RL7  ADXL367  [LGA-12]

### Nets
3V3 [3V3]: C1.2 C4.2 IC1.3_MISO/ASEL(MISO/ASEL) IC1.10_VS(VS) IC1.12_VDDIO(VDDIO)
GND: C1.1 C2.1 C4.1 IC1.1_SCLK(SCLK) IC1.7_GND(GND) IC1.8_ADC_IN(ADC_IN) IC1.11_GND(GND)
INT1 [signal]: IC1.5_INT1(INT1)
INT2 [signal]: IC1.6_INT2(INT2)
SCL [signal]: IC1.4_!CS!/SCL(!CS!/SCL)
SDA [signal]: IC1.2_MOSI/SDA(MOSI/SDA)
VREG: C2.2 IC1.9_VREG_OUT(VREG_OUT)

### Notes on the sheet
- I2C: 0x53

### Library data of the parts
C1 C2 C4 = rcl:C-EU: CAPACITOR, European symbol; SPICEPREFIX: C
IC1 = ADXL367 - Accelerometer:ADXL367

## Module ADJUSTABLE_LOAD
Ports: GND(pwr) IN(in) 3V3(pwr) DAC(in) SCL(in) SDA(io) A0(hiz) A1(hiz) G_ADJL(in) G_APPL(in) APP_LOW(in)
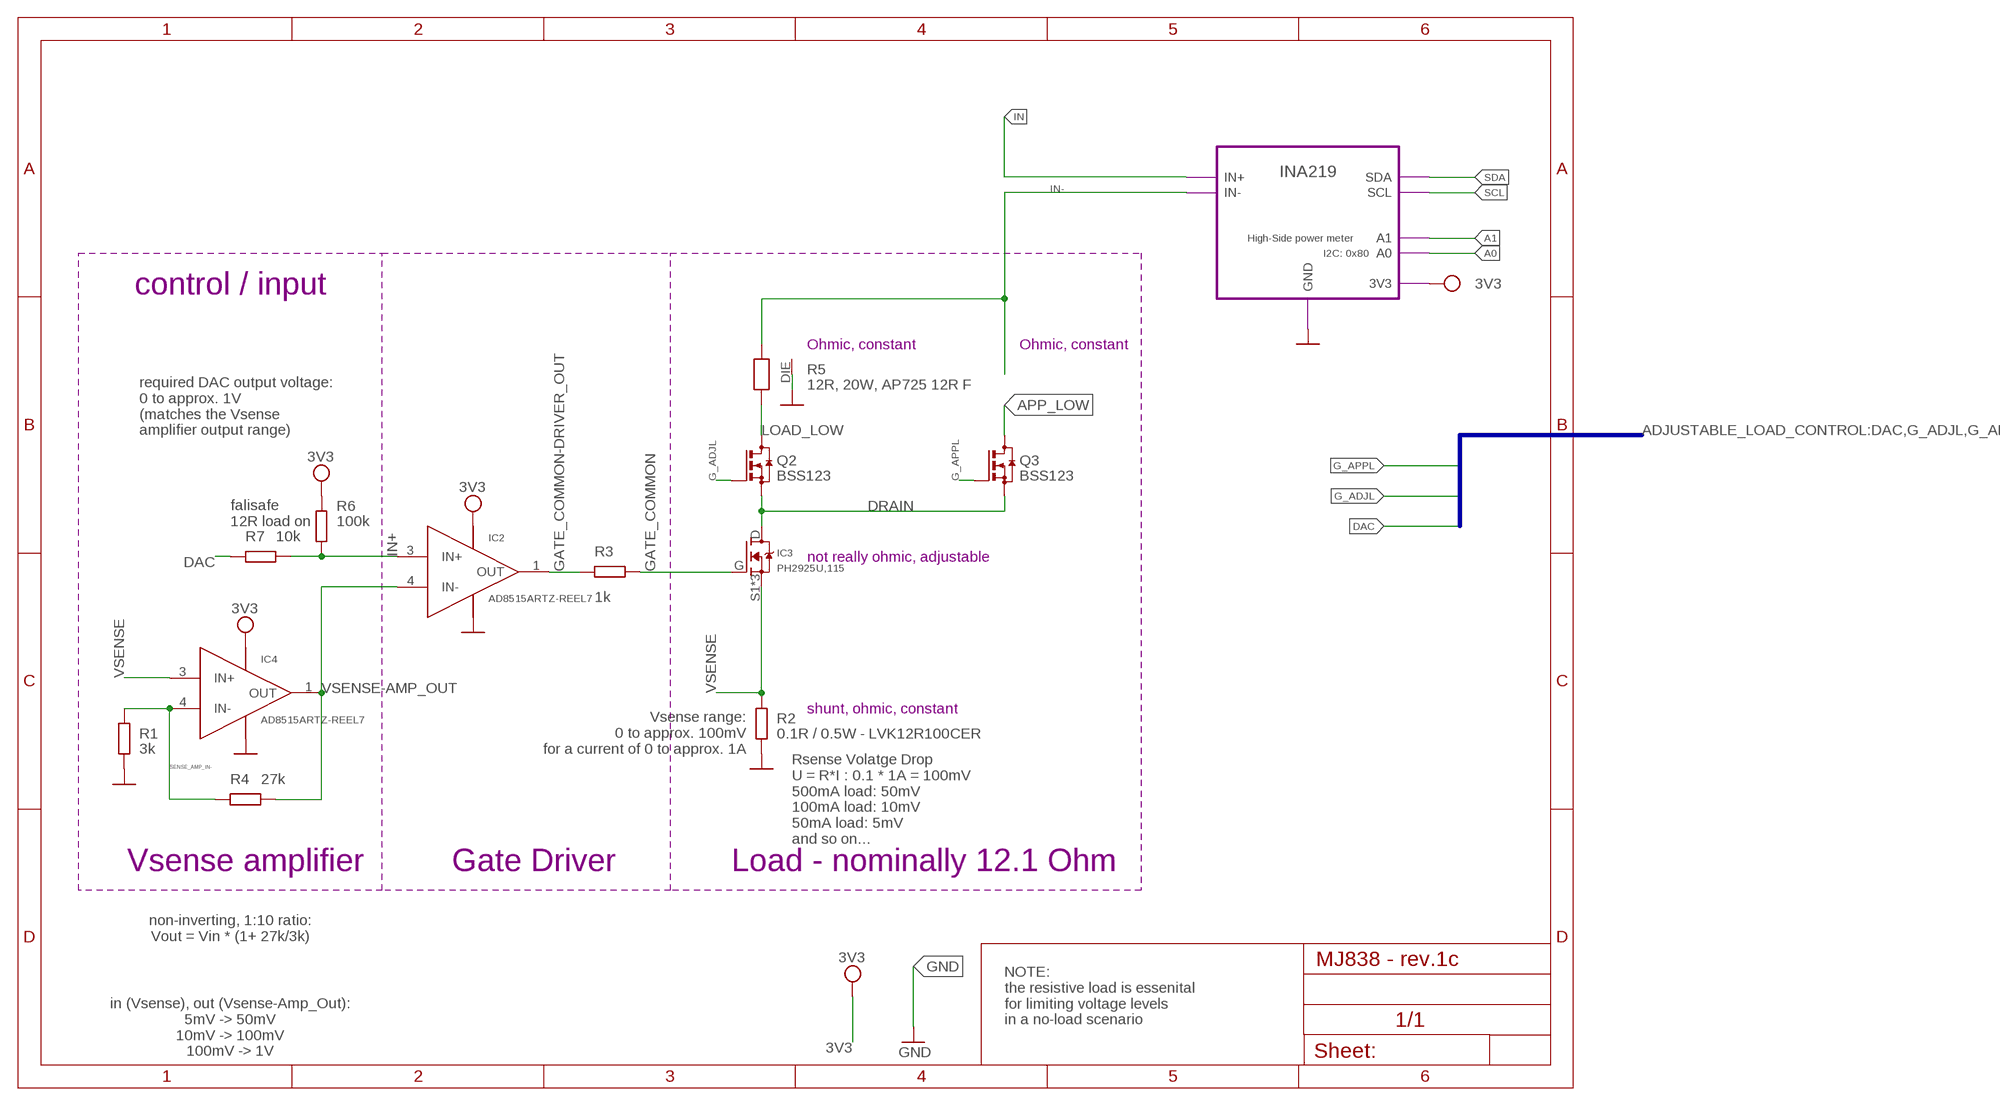
[diagram p19: schematic, module ADJUSTABLE_LOAD, sheet 1]

### Parts
IC2  AD8515ARTZ-REEL7  AD8515  [SOT-23-5]
IC3  PH2925U,115  PH2925U  [SOT669]
IC4  AD8515ARTZ-REEL7  AD8515  [SOT-23-5]
Q2  BSS123  [SOT23]
Q3  BSS123  [SOT23]
R1  3k  R-EU_R0402  [R0402]
R2  0.1R / 0.5W - LVK12R100CER  R-EU_R1206  [R1206]
R3  1k  R-EU_R0402  [R0402]
R4  27k  R-EU_R0402  [R0402]
R5  12R, 20W, AP725 12R F  AP72512RF  [TO-263-2]
R6  100k  R-EU_R0402  [R0402]
R7  10k  R-EU_R0402  [R0402]

### Module instances
INA219 = INA219

### Nets
3V3 [3V3]: IC2.5(V+) IC4.5(V+) R6.2 ; port INA219.3V3
A0 [signal]: port INA219.A0
A1 [signal]: port INA219.A1
APP_LOW [Vdc]: Q3.3(D)
DAC [signal]: R7.1
DRAIN [Vdc]: IC3.D Q2.2(S) Q3.2(S)
G_ADJL [signal]: Q2.1(G)
G_APPL [signal]: Q3.1(G)
GATE_COMMON: IC3.G R3.2
GATE_COMMON-DRIVER_OUT [signal]: IC2.1(OUT) R3.1
GND: IC2.2(V-) IC4.2(V-) R1.1 R2.1 R5.DIE(GND) ; port INA219.GND
IN [Vdc]: port INA219.IN+
IN+ [signal]: IC2.3(IN+) R6.1 R7.2
IN- [Vdc]: R5.2 ; port INA219.IN-
LOAD_LOW [Vdc]: Q2.3(D) R5.1
SCL [signal]: port INA219.SCL
SDA [signal]: port INA219.SDA
SENSE_AMP_IN- [signal]: IC4.4(IN-) R1.2 R4.1
VSENSE [Vdc]: IC3.S1(S) IC3.S2(S) IC3.S3(S) IC4.3(IN+) R2.2
VSENSE-AMP_OUT [signal]: IC2.4(IN-) IC4.1(OUT) R4.2

### Buses
ADJUSTABLE_LOAD_CONTROL:DAC,G_ADJL,G_APPL

### Notes on the sheet
- High-Side power meter
- I2C: 0x80
- control / input
- Ohmic, constant | Ohmic, constant
- required DAC output voltage:
  0 to approx. 1V
  (matches the Vsense
  amplifier output range)
- falisafe
  12R load on
- not really ohmic, adjustable
- shunt, ohmic, constant
- Vsense range:
  0 to approx. 100mV
  for a current of 0 to approx. 1A
- Rsense Volatge Drop
  U = R*I : 0.1 * 1A = 100mV 
  500mA load: 50mV
  100mA load: 10mV
  50mA load: 5mV
  and so on...
- Vsense amplifier | Gate Driver | Load - nominally 12.1 Ohm
- non-inverting, 1:10 ratio:
  Vout = Vin * (1+ 27k/3k)
- NOTE:
  the resistive load is essenital 
  for limiting voltage levels
  in a no-load scenario
- in (Vsense), out (Vsense-Amp_Out):
  5mV -> 50mV
  10mV -> 100mV
  100mV -> 1V

### Library data of the parts
IC2 IC4 = AD8515 - R2R IO OpAmp:AD8515
IC3 = PH2925U - N-Fet:PH2925U
Q2 Q3 = transistor-small-signal:BSS123: N-CHANNEL MOS FET
R1-R4 R6 R7 = rcl:R-EU_: RESISTOR, European symbol; SPICEPREFIX: R
R5 = AP725 12R F - 12R 20W Resistor:AP72512RF

## Module BLUETOOTH
Ports: GND(pwr) 3V3(pwr) RXD(in) TXD(out) CTS(in) RTS(out) !SW_BTN!(in) CONN_STAT(out) TRANS_STAT(out) WAKEUP(in) RST(in)
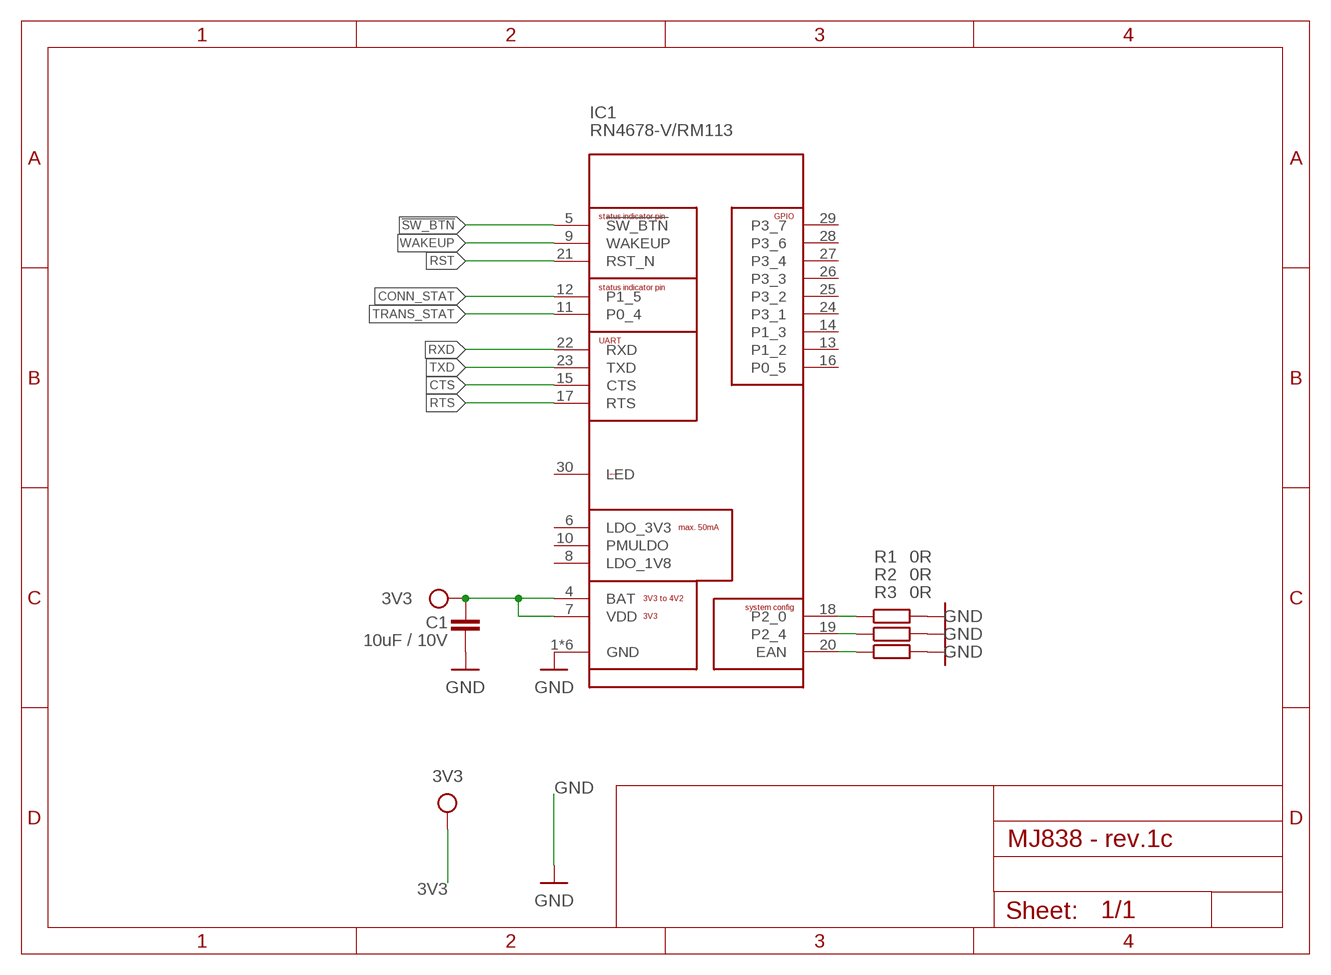
[diagram p20: schematic, module BLUETOOTH, sheet 1]

### Parts
C1  10uF / 10V  C-EUC0402  [C0402]
IC1  RN4678-V/RM113  RN4678-V/RM100  [MODULE_RN4678-V/RM100]
R1  0R  R-EU_R0402  [R0402]
R2  0R  R-EU_R0402  [R0402]
R3  0R  R-EU_R0402  [R0402]

### Nets
3V3 [3V3]: C1.2 IC1.4(BAT) IC1.7(VDD)
!SW_BTN! [signal]: IC1.5(!SW_BTN!)
CONN_STAT [signal]: IC1.12(P1_5)
CTS [signal]: IC1.15(CTS)
EAN: IC1.20(EAN) R3.1
GND: C1.1 IC1.1(GND) IC1.2(GND) IC1.3(GND) IC1.31(GND) IC1.32(GND) IC1.33(GND) R1.2 R2.2 R3.2
P2_0: IC1.18(P2_0) R1.1
P2_4: IC1.19(P2_4) R2.1
RST [signal]: IC1.21(RST_N)
RTS [signal]: IC1.17(RTS)
RXD [signal]: IC1.22(RXD)
TRANS_STAT [signal]: IC1.11(P0_4)
TXD [signal]: IC1.23(TXD)
WAKEUP [signal]: IC1.9(WAKEUP)
Unconnected: IC1.8(LDO_1V8) IC1.10(PMULDO) IC1.13(P1_2) IC1.14(P1_3) IC1.16(P0_5) IC1.24(P3_1) IC1.25(P3_2) IC1.26(P3_3) IC1.27(P3_4) IC1.28(P3_6) IC1.29(P3_7)

### Power pins joined to a net without a drawn wire
LDO_3V3: IC1.6(LDO_3V3)
LED: IC1.30(LED)

### Library data of the parts
C1 = rcl:C-EU: CAPACITOR, European symbol; MFRNO: GRM155R61A106ME11D; SPICEPREFIX: C
IC1 = RN4678 Bluetooth Dual Mode Module:RN4678-V/RM100: Check availability <https://pricing.snapeda.com/parts/RN4678-V/RM100/Microchip/view-part?ref=eda>
R1-R3 = rcl:R-EU_: RESISTOR, European symbol; SPICEPREFIX: R

## Module DYNAMO_OVP
Ports: N1(pwr) N2(pwr)
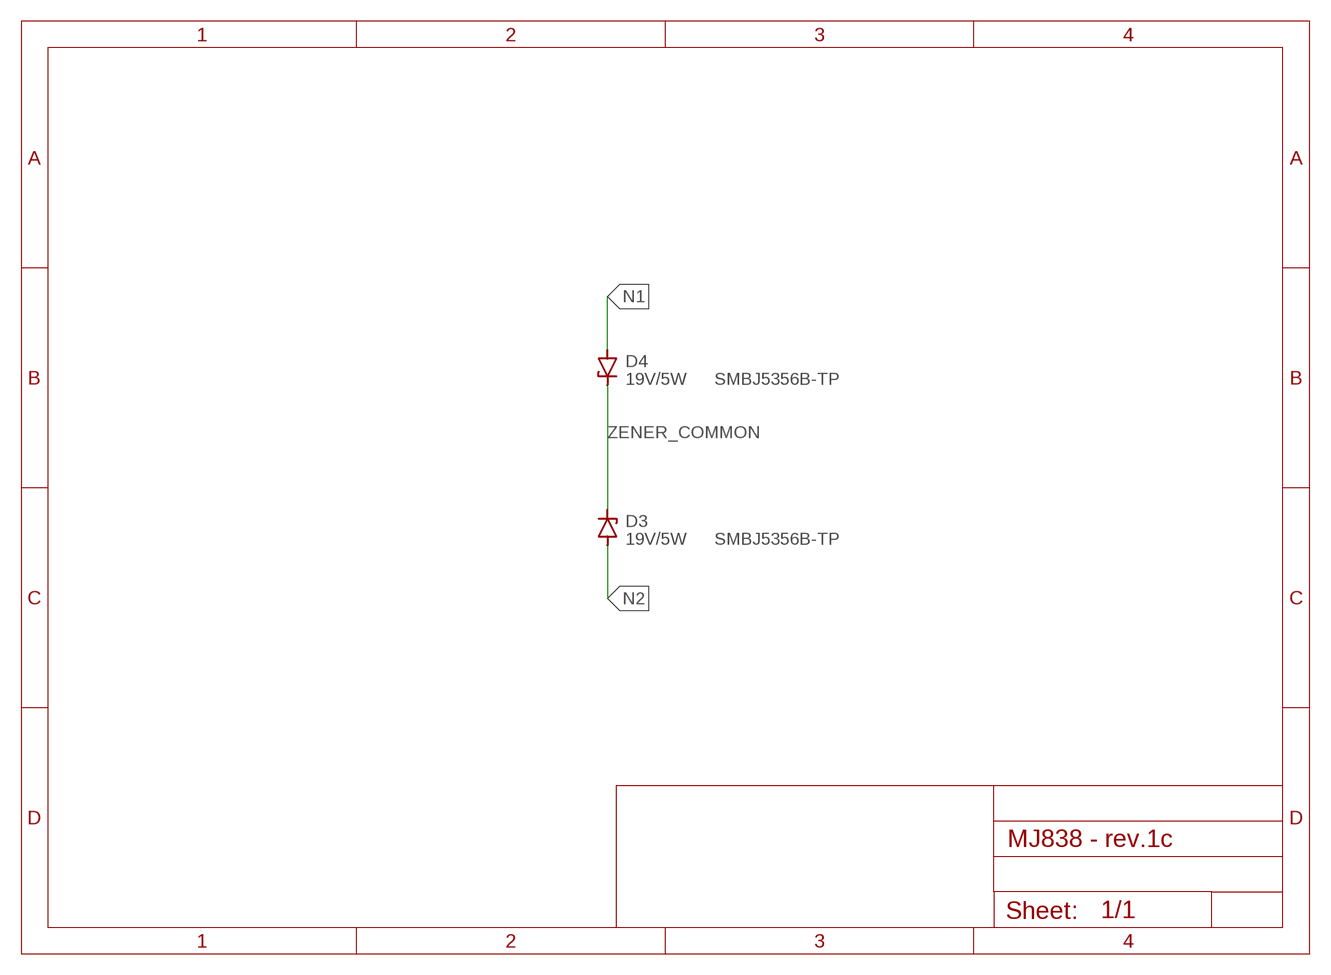
[diagram p21: schematic, module DYNAMO_OVP, sheet 1]

### Parts
D3  19V/5W  ZENER-DIODEDO214AA  [DO214AA]
D4  19V/5W  ZENER-DIODEDO214AA  [DO214AA]

### Nets
N1 [Vdynamo]: D4.A
N2 [Vdynamo]: D3.A
ZENER_COMMON [Vdynamo]: D3.C D4.C

### Notes on the sheet
- SMBJ5356B-TP
- SMBJ5356B-TP

### Library data of the parts
D3 D4 = diode:ZENER-DIODE: Z-Diode

## Module RECTIFIER
Ports: GND(pwr) ZEROCROSS(out) 3V3(pwr) VDC(pwr) BAT(pwr) SCL(in) SDA(io) !LED_RESET!(in) PHASE(out) N1(pwr) N2(pwr)
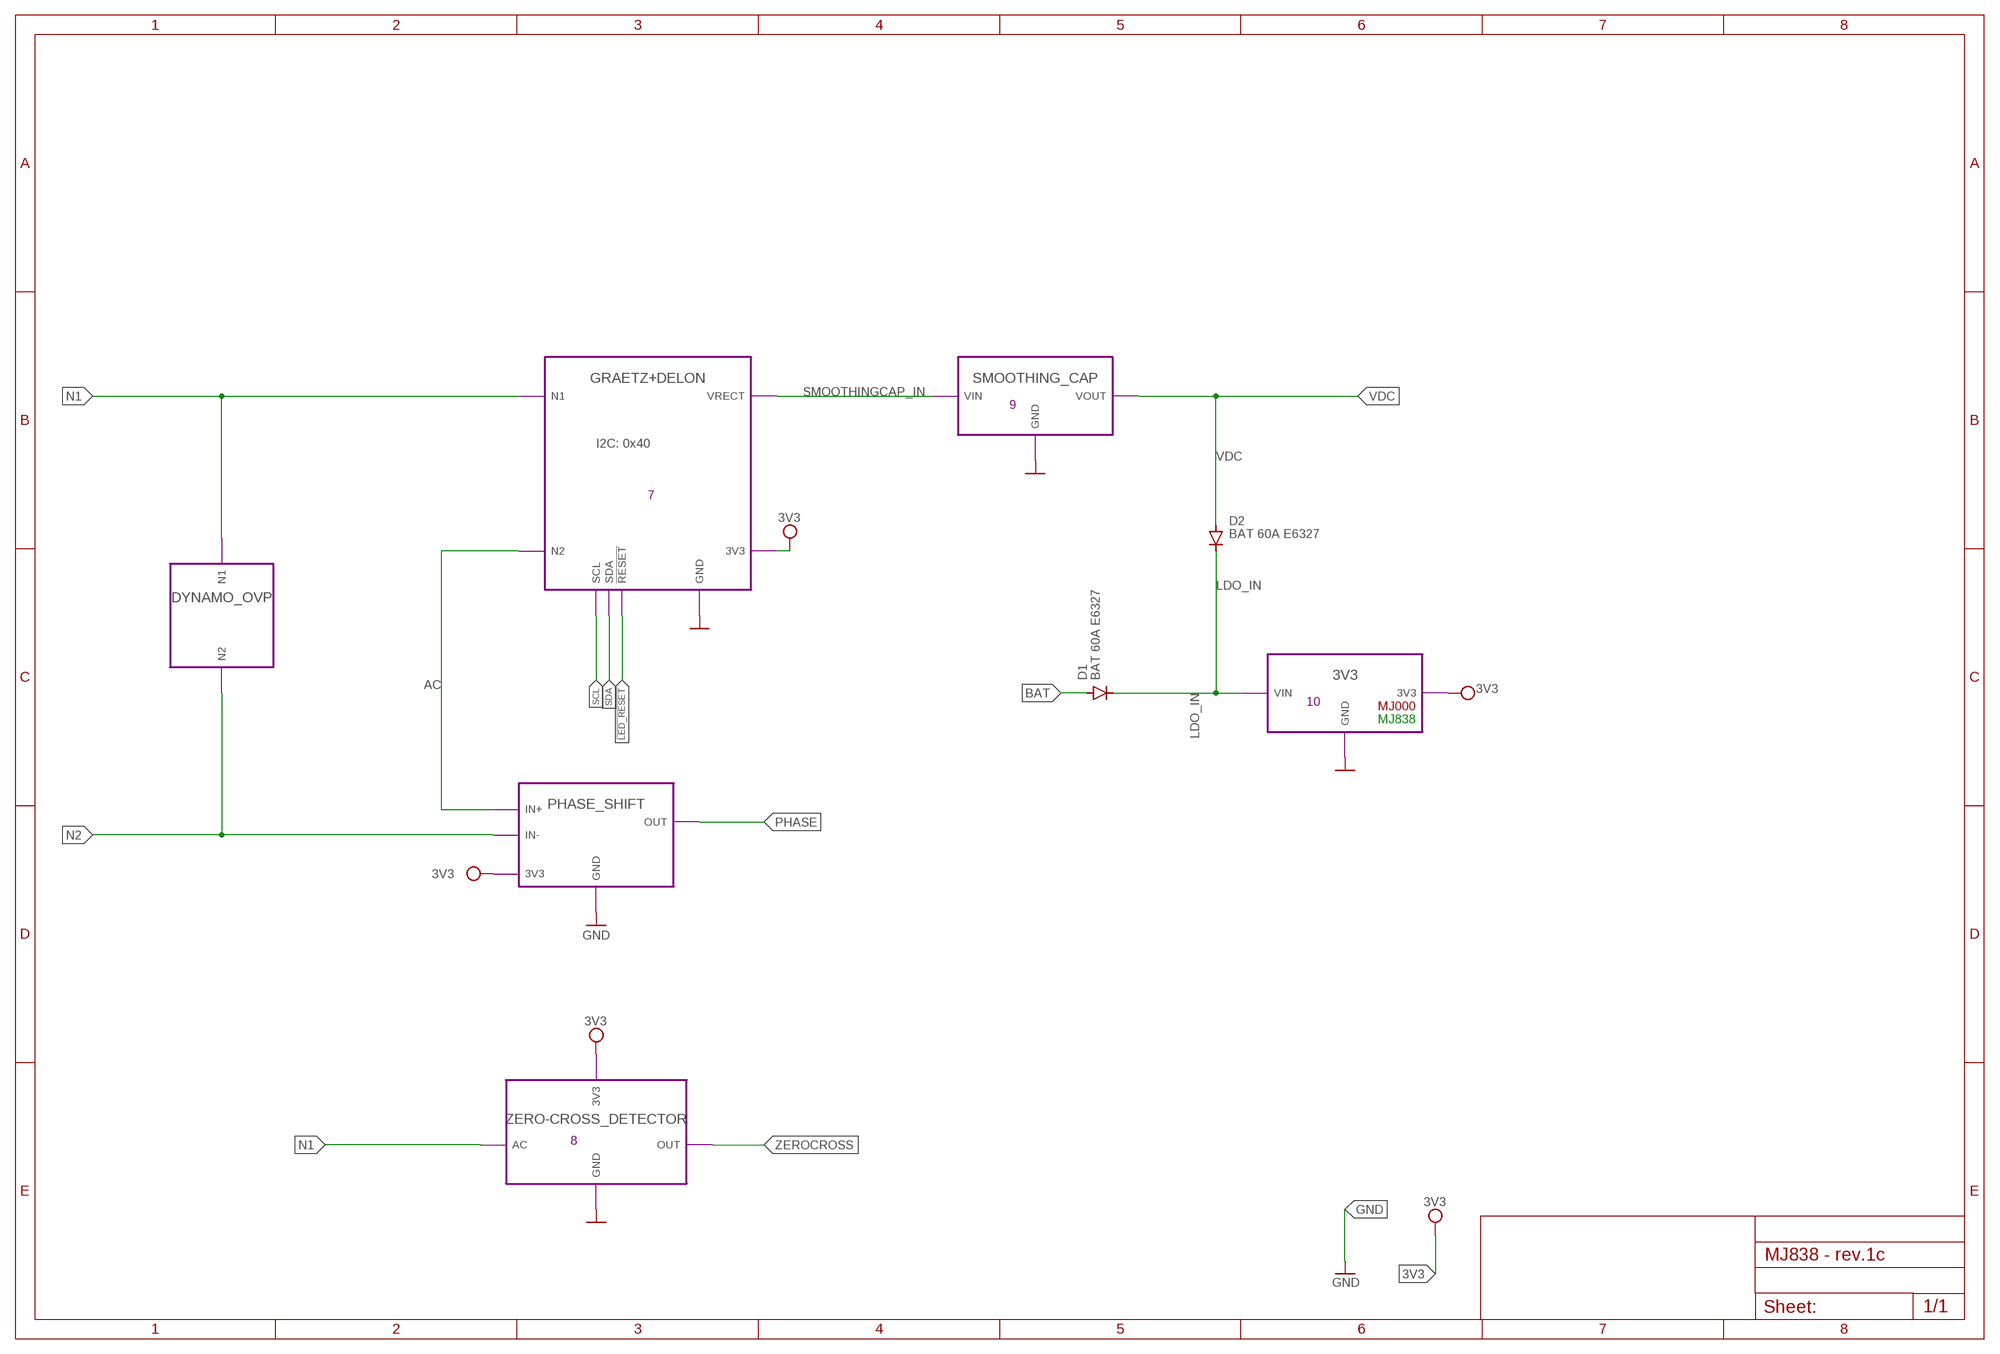
[diagram p22: schematic, module RECTIFIER, sheet 1]

### Parts
D1  BAT 60A E6327  DIODE-SOD323-W  [SOD323-W]
D2  BAT 60A E6327  DIODE-SOD323-W  [SOD323-W]

### Module instances
ZERO-CROSS_DETECTOR = ZERO-CROSS_DETECTOR
3V3 = 3V3
SMOOTHING_CAP = SMOOTHING_CAP
GRAETZ+DELON = GRAETZ+DELON
PHASE_SHIFT = PHASE_SHIFT
DYNAMO_OVP = DYNAMO_OVP

### Nets
3V3 [3V3]: port ZERO-CROSS_DETECTOR.3V3 3V3.3V3 GRAETZ+DELON.3V3 PHASE_SHIFT.3V3
!LED_RESET! [signal]: port GRAETZ+DELON.!RESET!
AC [Vdynamo]: port GRAETZ+DELON.N2 PHASE_SHIFT.IN+
BAT [BAT+]: D1.A
GND: port ZERO-CROSS_DETECTOR.GND 3V3.GND SMOOTHING_CAP.GND GRAETZ+DELON.GND PHASE_SHIFT.GND
LDO_IN [BAT+]: D1.C D2.C ; port 3V3.VIN
N1 [Vdynamo]: port GRAETZ+DELON.N1 DYNAMO_OVP.N1 ZERO-CROSS_DETECTOR.AC
N2 [Vdynamo]: port PHASE_SHIFT.IN- DYNAMO_OVP.N2
PHASE [signal]: port PHASE_SHIFT.OUT
SCL [signal]: port GRAETZ+DELON.SCL
SDA [signal]: port GRAETZ+DELON.SDA
SMOOTHINGCAP_IN [Vac]: port GRAETZ+DELON.VRECT SMOOTHING_CAP.VIN
VDC [Vdc]: D2.A ; port SMOOTHING_CAP.VOUT
ZEROCROSS [signal]: port ZERO-CROSS_DETECTOR.OUT

### Notes on the sheet
- 9
- I2C: 0x40
- 7
- 10 | MJ000
- MJ838
- 8

### Library data of the parts
D1 D2 = diode:DIODE-: DIODE

## Net classes
0 GND: width 0.25 mm, drill 0.35 mm, clearance 0.19 mm
1 BAT+: width 0.5 mm, drill 0.35 mm, clearance 0.5 mm to class 0, clearance 0.5 mm
2 signal: width 0.25 mm, drill 0.35 mm, clearance 0.19 mm to class 0, clearance 0.19 mm to class 1, clearance 0.19 mm
3 3V3: width 0.25 mm, drill 0.35 mm, clearance 0.19 mm to class 0, clearance 0.19 mm to class 1, clearance 0.19 mm to class 2, clearance 0.19 mm
4 Vdc: width 0.5 mm, drill 0.35 mm, clearance 0.5 mm to class 0, clearance 0.5 mm to class 1, clearance 0.5 mm to class 2, clearance 0.5 mm to class 3, clearance 0.5 mm
5 Vdynamo: width 0.5 mm, drill 0.35 mm, clearance 0.5 mm to class 0, clearance 0.5 mm to class 1, clearance 0.5 mm to class 2, clearance 0.5 mm to class 3, clearance 0.5 mm to class 4, clearance 0.5 mm
6 Vac: width 0.5 mm, drill 0.35 mm, clearance 0.5 mm to class 0, clearance 0.5 mm to class 1, clearance 0.5 mm to class 2, clearance 0.5 mm to class 3, clearance 0.5 mm to class 4, clearance 0.5 mm to class 5, clearance 0.5 mm